# EAGLE design speedometer (EAGLE 9.1.3)

## Sheet 1 of 7: Main chip
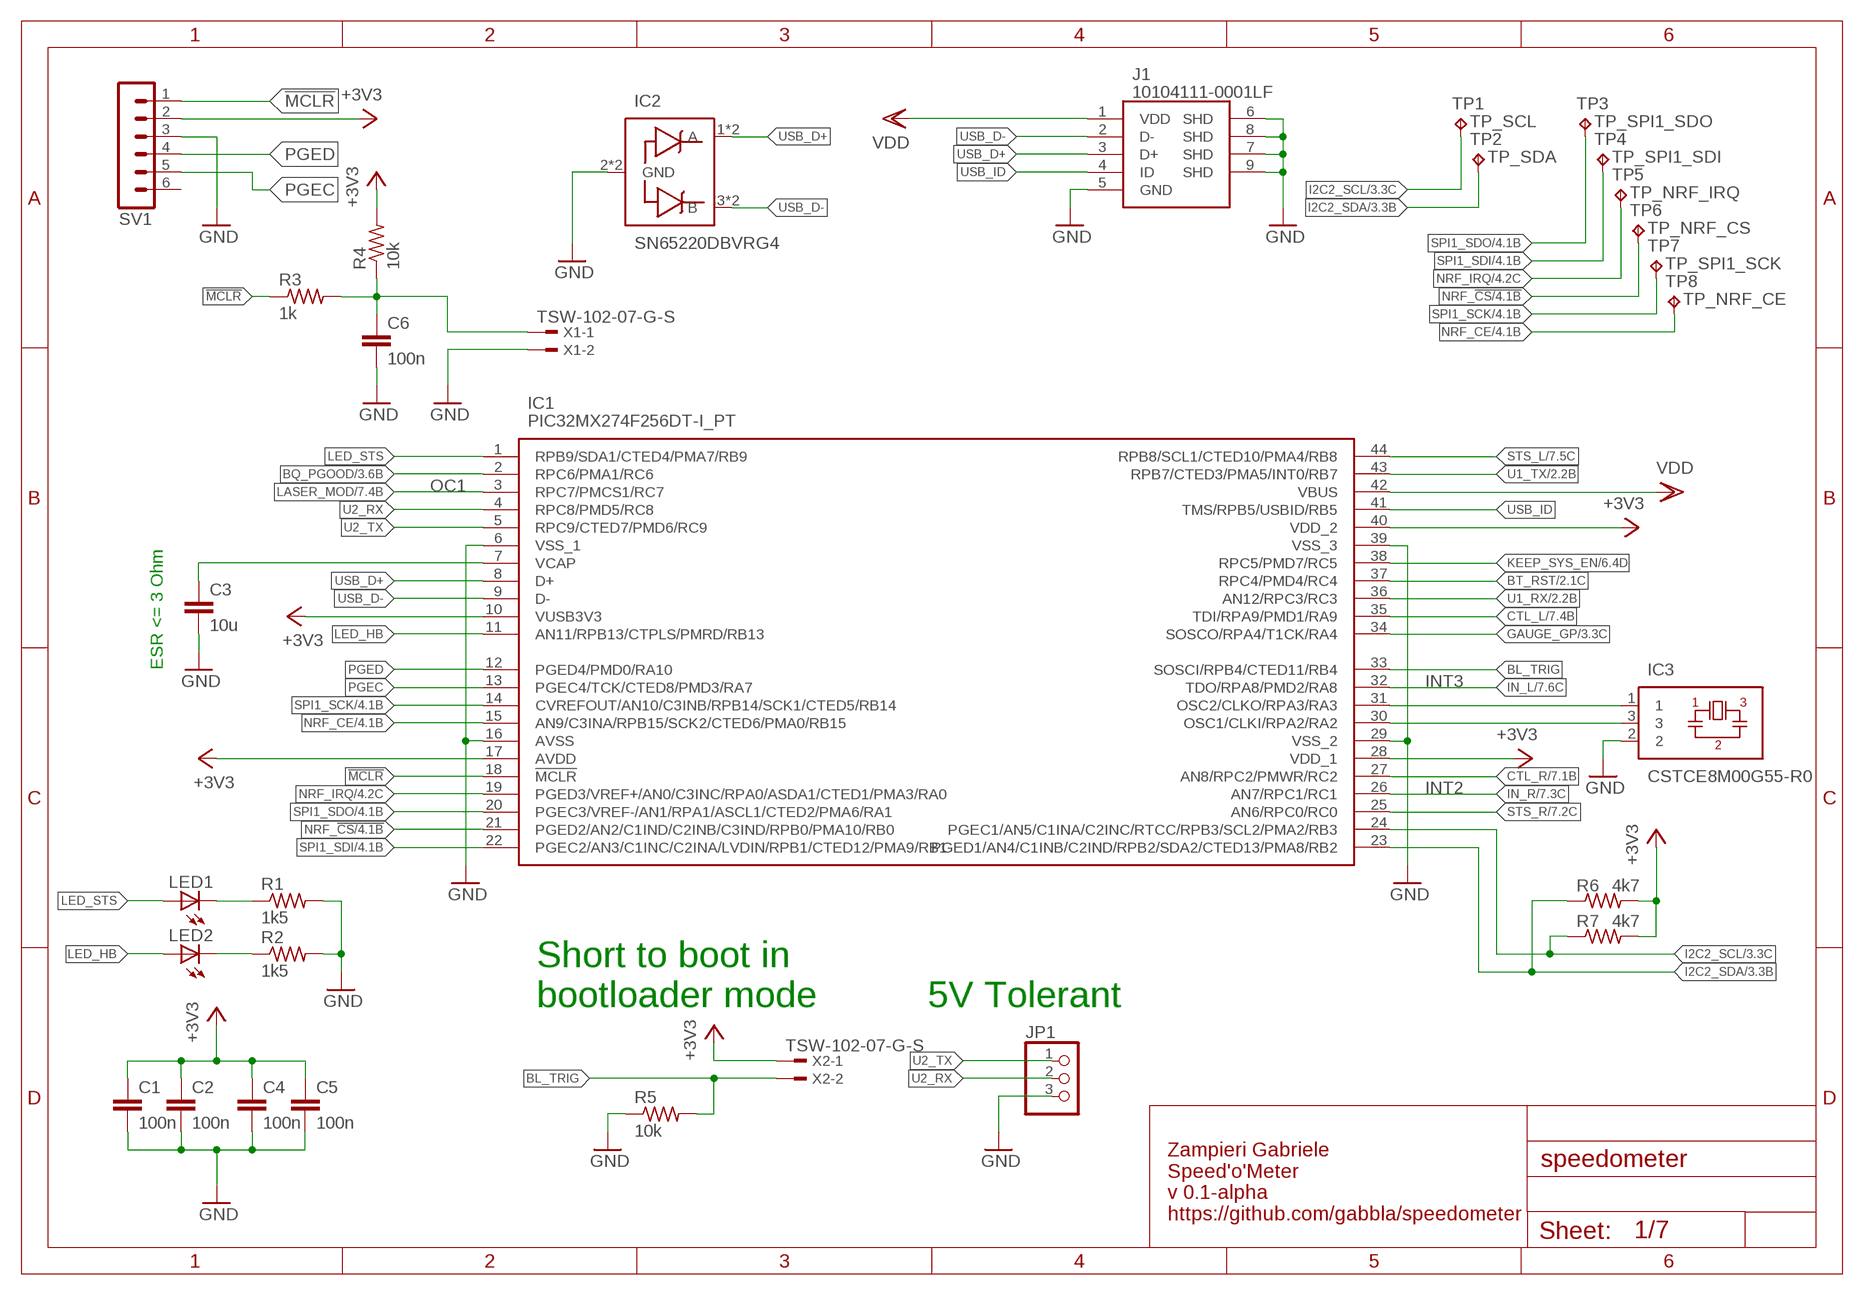
[diagram p0: schematic, sheet 1]

### Parts
C1  100n  C-EUC0603K  [C0603K]
C2  100n  C-EUC0603K  [C0603K]
C3  10u  C-EUC0805K  [C0805K]
C4  100n  C-EUC0603K  [C0603K]
C5  100n  C-EUC0603K  [C0603K]
C6  100n  C-EUC0603K  [C0603K]
IC1  PIC32MX274F256DT-I_PT  [QFP80P1200X1200X120-44N]
IC2  SN65220DBVRG4  [SOT95P280X145-6N]
IC3  CSTCE8M00G55-R0  CSTCE12M0G15L99-R0  [CSTCE_G]
J1  10104111-0001LF  [MICRO_USB_A/B_TYPE_RECEPTACLE]
JP1  PINHD-1X3  [1X03]
LED1  LED3MM  [LED3MM]
LED2  LEDCHIPLED_0805  [CHIPLED_0805]
R1  1k5  R-US_R0603  [R0603]
R2  1k5  R-US_R0603  [R0603]
R3  1k  R-US_R0603  [R0603]
R4  10k  R-US_R0603  [R0603]
R5  10k  R-US_R0603  [R0603]
R6  4k7  R-US_R0603  [R0603]
R7  4k7  R-US_R0603  [R0603]
SV1  MA06-1  [MA06-1]
TP1  TPB1,27  [B1,27]
TP2  TPB1,27  [B1,27]
TP3  TPB1,27  [B1,27]
TP4  TPB1,27  [B1,27]
TP5  TPB1,27  [B1,27]
TP6  TPB1,27  [B1,27]
TP7  TPB1,27  [B1,27]
TP8  TPB1,27  [B1,27]
X1  TSW-102-07-G-S  [TSW-102-XX-G-S]
X2  TSW-102-07-G-S  [TSW-102-XX-G-S]

### Nets
!MCLR: IC1.18(!MCLR) R3.1 SV1.1
+3V3: C1.1 C2.1 C4.1 C5.1 IC1.10(VUSB3V3) IC1.17(AVDD) IC1.28(VDD_1) IC1.40(VDD_2) R4.2 R6.2 R7.2 SV1.2 X2.1 ; also sheet 2,3,4,5,6,7
BL_TRIG: IC1.33(SOSCI/RPB4/CTED11/RB4) R5.2 X2.2
BQ_PGOOD: IC1.2(RPC6/PMA1/RC6) ; also sheet 3
BT_RST: IC1.37(RPC4/PMD4/RC4) ; also sheet 2
CTL_L: IC1.35(TDI/RPA9/PMD1/RA9) ; also sheet 7
CTL_R: IC1.27(AN8/RPC2/PMWR/RC2) ; also sheet 7
GAUGE_GP: IC1.34(SOSCO/RPA4/T1CK/RA4) ; also sheet 3
GND: C1.2 C2.2 C3.2 C4.2 C5.2 C6.2 IC1.6(VSS_1) IC1.16(AVSS) IC1.29(VSS_2) IC1.39(VSS_3) IC2.2(GND) IC2.5(GND) IC3.2 J1.5(GND) J1.6(SHD) J1.7(SHD) J1.8(SHD) J1.9(SHD) JP1.3 R1.2 R2.2 R5.1 SV1.3 X1.2 ; also sheet 2,3,4,5,6,7
I2C2_SCL: IC1.24(PGEC1/AN5/C1INA/C2INC/RTCC/RPB3/SCL2/PMA2/RB3) R7.1 TP1.TP ; also sheet 3,5
I2C2_SDA: IC1.23(PGED1/AN4/C1INB/C2IND/RPB2/SDA2/CTED13/PMA8/RB2) R6.1 TP2.TP ; also sheet 3,5
IN_L: IC1.32(TDO/RPA8/PMD2/RA8) ; also sheet 7
IN_R: IC1.26(AN7/RPC1/RC1) ; also sheet 7
KEEP_SYS_EN: IC1.38(RPC5/PMD7/RC5) ; also sheet 6
LASER_MOD: IC1.3(RPC7/PMCS1/RC7) ; also sheet 7
LED_HB: IC1.11(AN11/RPB13/CTPLS/PMRD/RB13) LED2.A
LED_STS: IC1.1(RPB9/SDA1/CTED4/PMA7/RB9) LED1.A
N$10: LED1.K(C) R1.1
N$11: IC1.31(OSC2/CLKO/RPA3/RA3) IC3.1
N$19: IC1.30(OSC1/CLKI/RPA2/RA2) IC3.3
N$21: C3.1 IC1.7(VCAP)
N$29: LED2.C R2.1
N$41: C6.1 R3.2 R4.1 X1.1
NRF_!CS: IC1.21(PGED2/AN2/C1IND/C2INB/C3IND/RPB0/PMA10/RB0) TP6.TP ; also sheet 4
NRF_CE: IC1.15(AN9/C3INA/RPB15/SCK2/CTED6/PMA0/RB15) TP8.TP ; also sheet 4
NRF_IRQ: IC1.19(PGED3/VREF+/AN0/C3INC/RPA0/ASDA1/CTED1/PMA3/RA0) TP5.TP ; also sheet 4
PGEC: IC1.13(PGEC4/TCK/CTED8/PMD3/RA7) SV1.5
PGED: IC1.12(PGED4/PMD0/RA10) SV1.4
SPI1_SCK: IC1.14(CVREFOUT/AN10/C3INB/RPB14/SCK1/CTED5/RB14) TP7.TP ; also sheet 4
SPI1_SDI: IC1.22(PGEC2/AN3/C1INC/C2INA/LVDIN/RPB1/CTED12/PMA9/RB1) TP4.TP ; also sheet 4
SPI1_SDO: IC1.20(PGEC3/VREF-/AN1/RPA1/ASCL1/CTED2/PMA6/RA1) TP3.TP ; also sheet 4
STS_L: IC1.44(RPB8/SCL1/CTED10/PMA4/RB8) ; also sheet 7
STS_R: IC1.25(AN6/RPC0/RC0) ; also sheet 7
U1_RX: IC1.36(AN12/RPC3/RC3) ; also sheet 2
U1_TX: IC1.43(RPB7/CTED3/PMA5/INT0/RB7) ; also sheet 2
U2_RX: IC1.4(RPC8/PMD5/RC8) JP1.2
U2_TX: IC1.5(RPC9/CTED7/PMD6/RC9) JP1.1
USB_D+: IC1.8(D+) IC2.1(A) IC2.6(A) J1.3(D+)
USB_D-: IC1.9(D-) IC2.3(B) IC2.4(B) J1.2(D-)
USB_ID: IC1.41(TMS/RPB5/USBID/RB5) J1.4(ID)
VDD: IC1.42(VBUS) J1.1(VDD) ; also sheet 3
Unconnected: SV1.6

### Notes on the sheet
- OC1
- ESR <= 3 Ohm
- INT3
- INT2
- Short to boot in
  bootloader mode
- 5V Tolerant
- Zampieri Gabriele
  Speed'o'Meter 
  v 0.1-alpha
  https://github.com/gabbla/speedometer

## Sheet 2 of 7: NPI
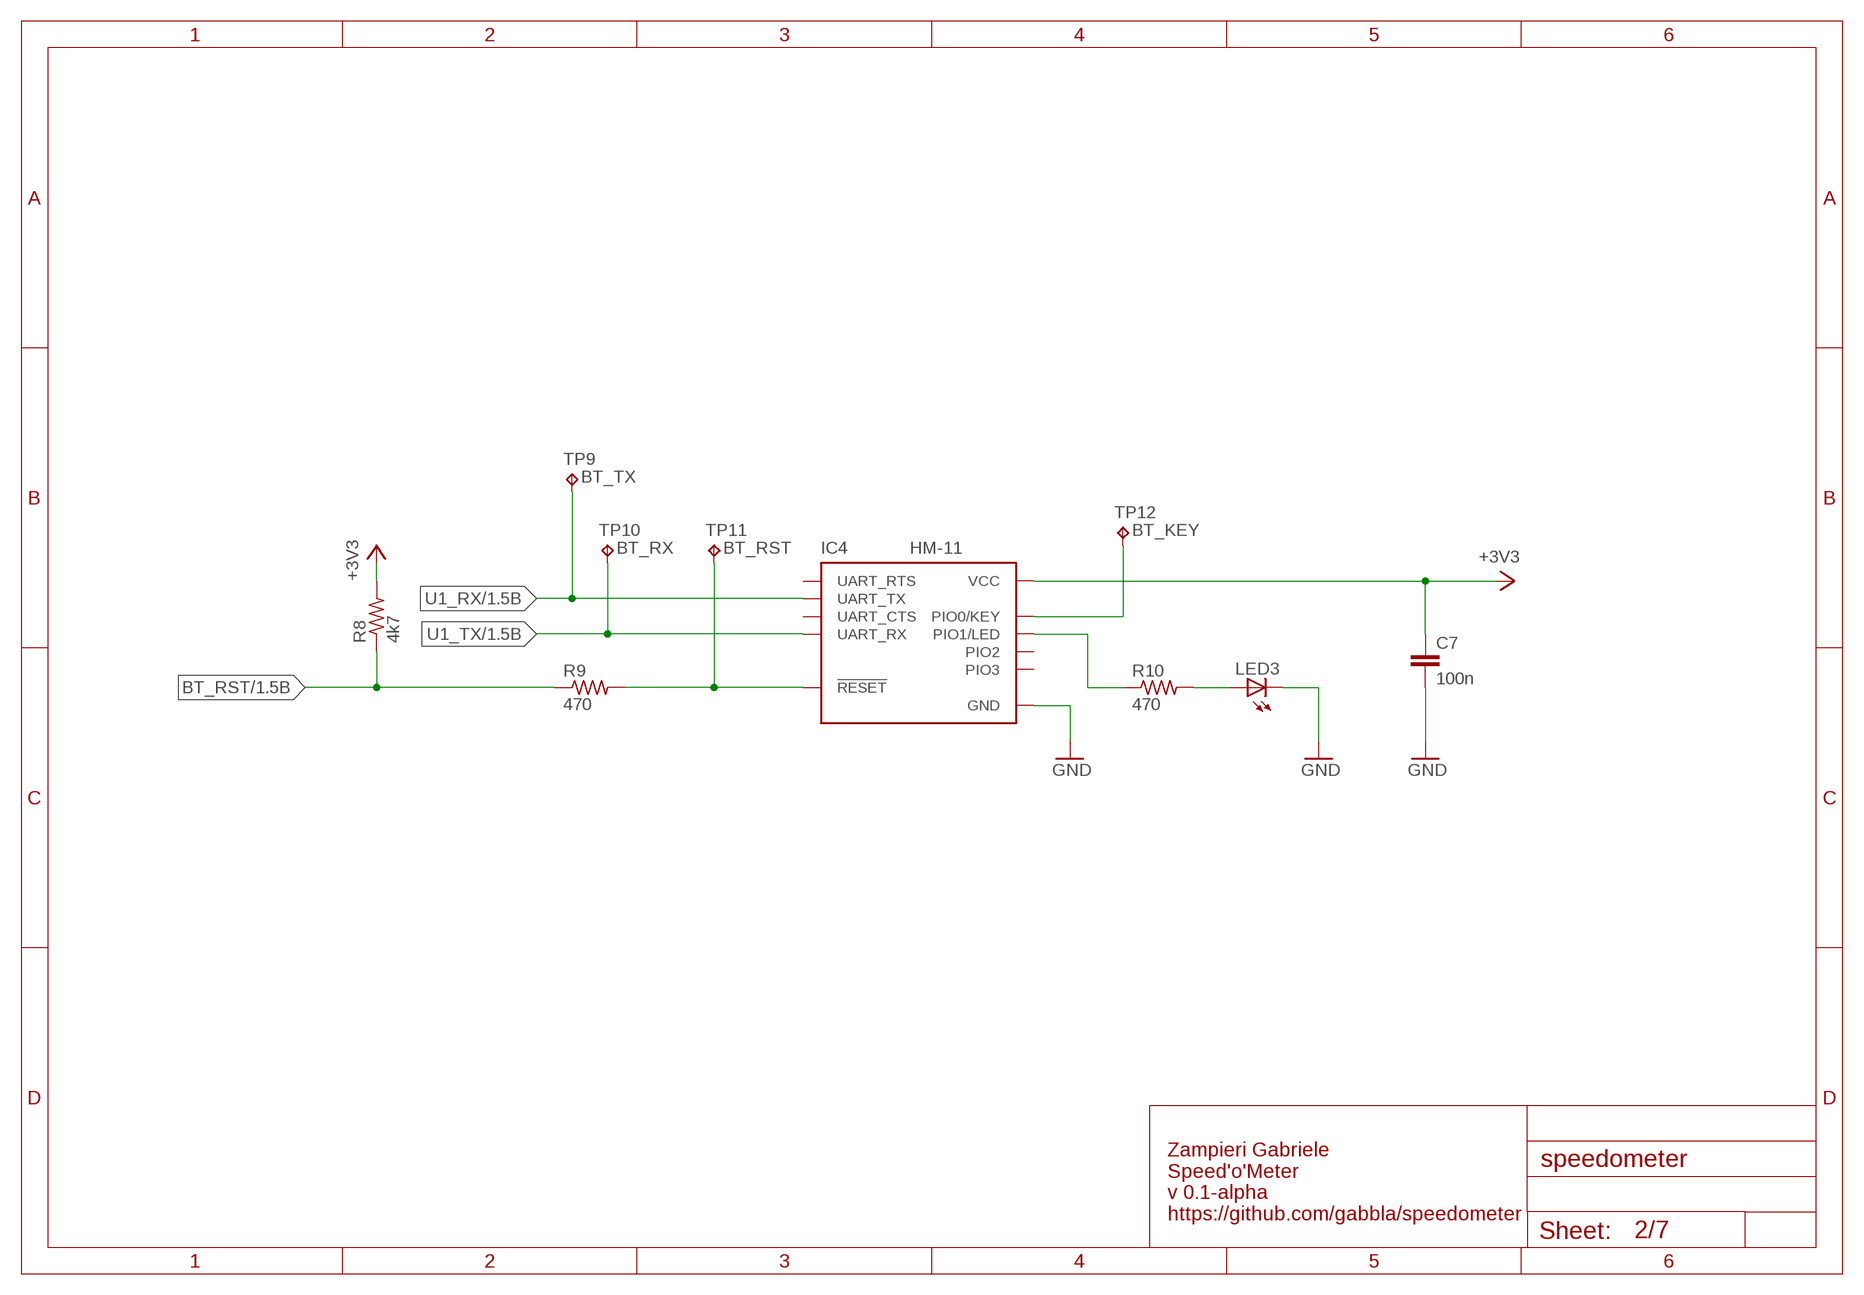
[diagram p1: schematic, sheet 2]

### Parts
C7  100n  C-EUC0603K  [C0603K]
IC4  HM-11  [HM-11]
LED3  LED3MM  [LED3MM]
R8  4k7  R-US_R0603  [R0603]
R9  470  R-US_R0603  [R0603]
R10  470  R-US_R0603  [R0603]
TP9  TPB1,27  [B1,27]
TP10  TPB1,27  [B1,27]
TP11  TPB1,27  [B1,27]
TP12  TPB1,27  [B1,27]

### Nets
+3V3: C7.1 IC4.VCC R8.2 ; also sheet 1,3,4,5,6,7
BT_RST: R8.1 R9.1 ; also sheet 1
GND: C7.2 IC4.GND LED3.K(C) ; also sheet 1,3,4,5,6,7
N$1: IC4.RESETB(!RESET) R9.2 TP11.TP
N$2: IC4.PIO0(PIO0/KEY) TP12.TP
N$4: IC4.PIO1(PIO1/LED) R10.1
N$6: LED3.A R10.2
U1_RX: IC4.UART_TX TP9.TP ; also sheet 1
U1_TX: IC4.UART_RX TP10.TP ; also sheet 1
Unconnected: IC4.PIO2 IC4.PIO3 IC4.UART_CTS IC4.UART_RTS

### Notes on the sheet
- Zampieri Gabriele
  Speed'o'Meter 
  v 0.1-alpha
  https://github.com/gabbla/speedometer

## Sheet 3 of 7: Battery Managment
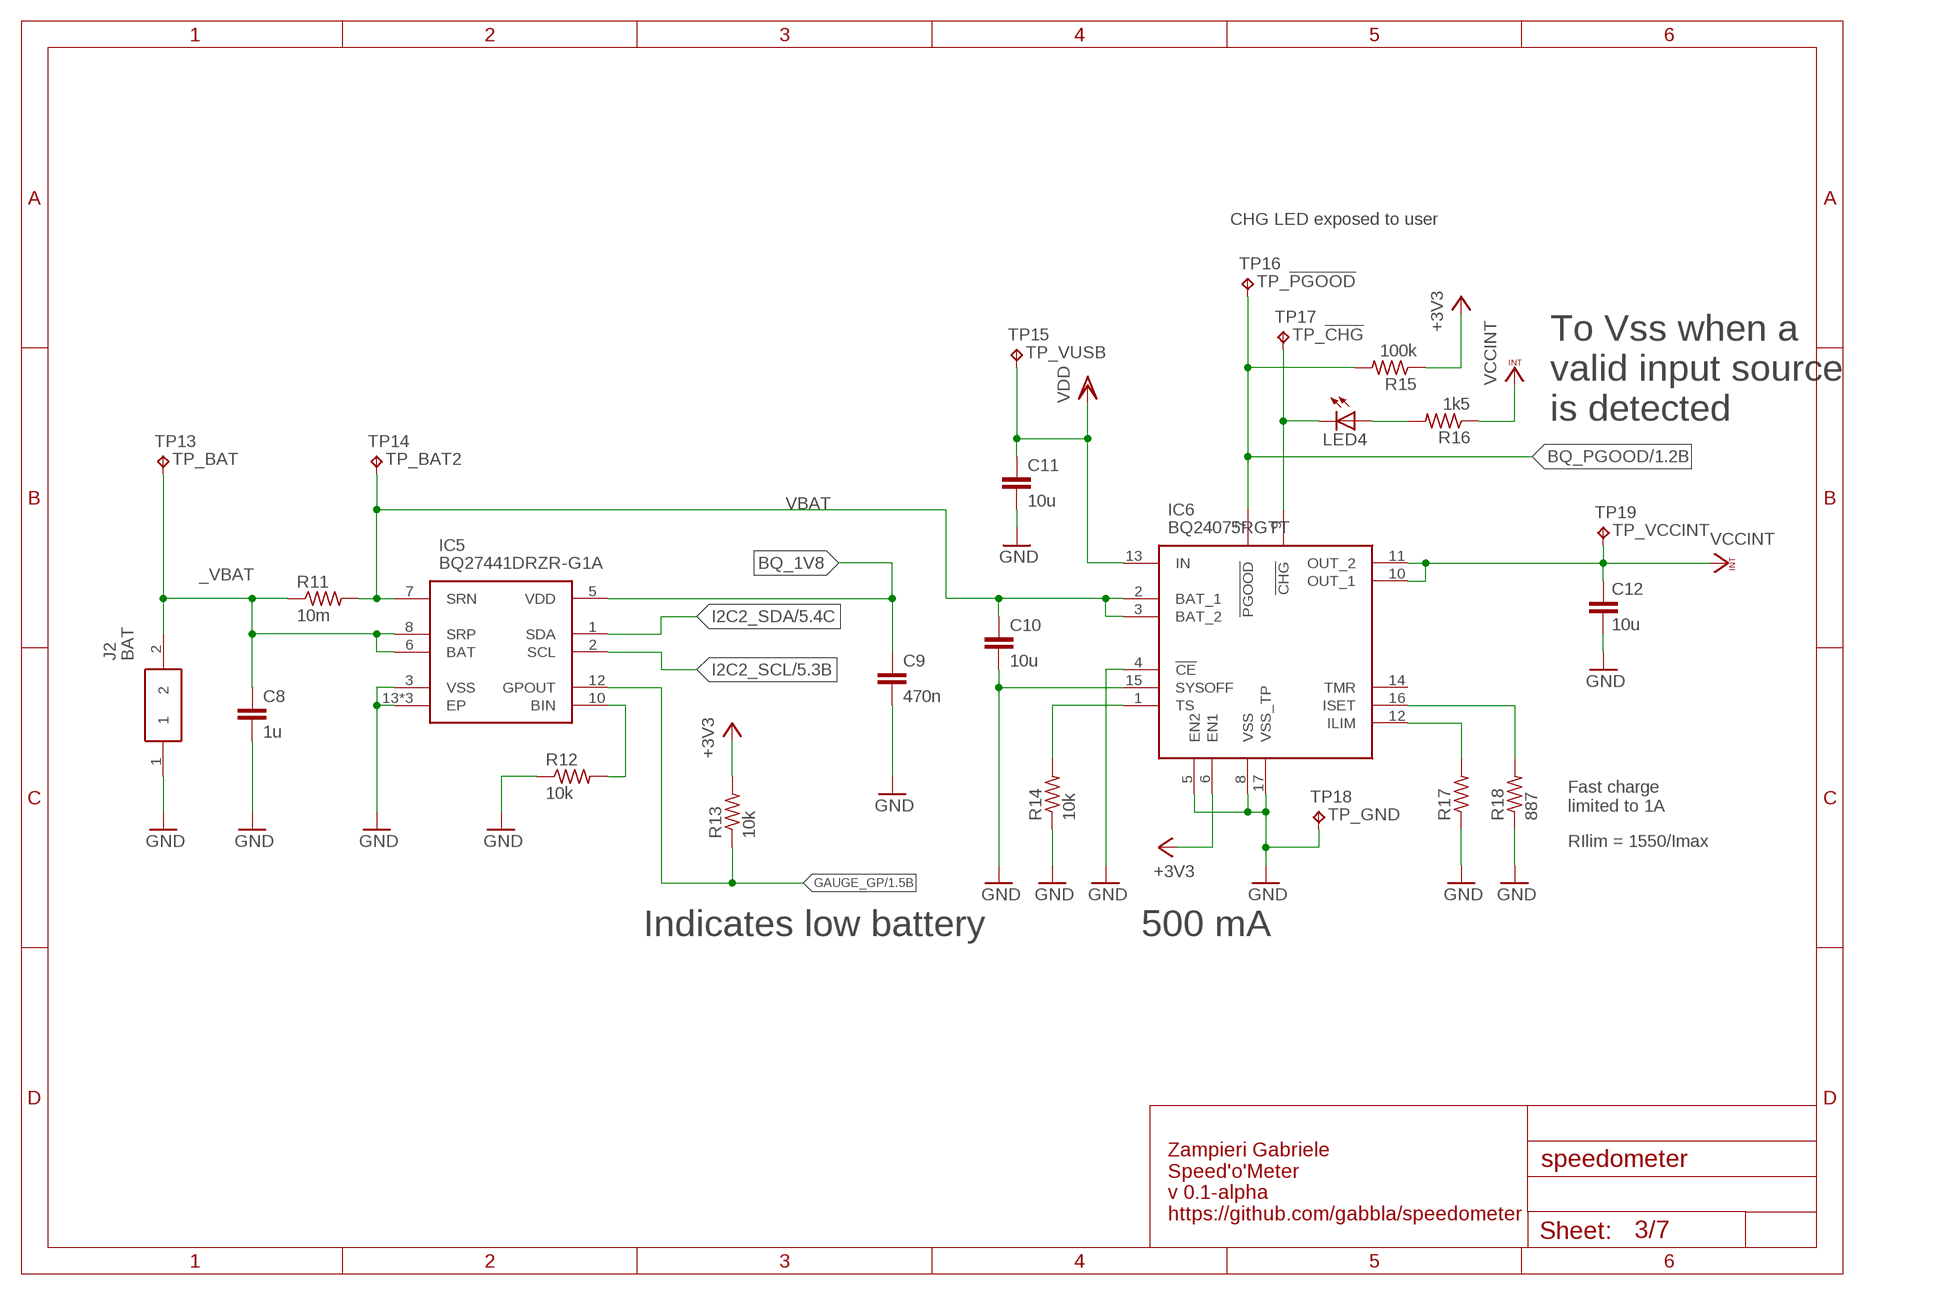
[diagram p2: schematic, sheet 3]

### Parts
C8  1u  C-EUC0603K  [C0603K]
C9  470n  C-EUC0603K  [C0603K]
C10  10u  C-EUC0805K  [C0805K]
C11  10u  C-EUC0805K  [C0805K]
C12  10u  C-EUC0805K  [C0805K]
IC5  BQ27441DRZR-G1A  [BQ27441DRZRG1A]
IC6  BQ24075RGTT  [QFN50P300X300X80-17N]
J2  BAT  B2B-PH-SM4-TB(LF)(SN)  [B2B-PH-SM4-TB]
LED4  LED3MM  [LED3MM]
R11  10m  R-US_R2512  [R2512]
R12  10k  R-US_R0603  [R0603]
R13  10k  R-US_R0603  [R0603]
R14  10k  R-US_R0603  [R0603]
R15  100k  R-US_R0603  [R0603]
R16  1k5  R-US_R0603  [R0603]
R17  R-US_R0603  [R0603]
R18  887  R-US_R0603  [R0603]
TP13  TPB1,27  [B1,27]
TP14  TPB1,27  [B1,27]
TP15  TPB1,27  [B1,27]
TP16  TPB1,27  [B1,27]
TP17  TPB1,27  [B1,27]
TP18  TPB1,27  [B1,27]
TP19  TPB1,27  [B1,27]

### Nets
!BAT_CHG: IC6.9(!CHG) LED4.K(C) TP17.TP
+3V3: IC6.6(EN1) R13.2 R15.1 ; also sheet 1,2,4,5,6,7
_VBAT: C8.1 IC5.6(BAT) IC5.8(SRP) J2.2 R11.1 TP13.TP
BQ_1V8: C9.1 IC5.5(VDD)
BQ_PGOOD: IC6.7(!PGOOD) R15.2 TP16.TP ; also sheet 1
GAUGE_GP: IC5.12(GPOUT) R13.1 ; also sheet 1
GND: C8.2 C9.2 C10.2 C11.2 C12.2 IC5.3(VSS) IC5.13(EP) IC5.14(EP) IC5.15(EP) IC6.4(!CE) IC6.5(EN2) IC6.8(VSS) IC6.15(SYSOFF) IC6.17(VSS_TP) J2.1 R12.1 R14.1 R17.1 R18.1 TP18.TP ; also sheet 1,2,4,5,6,7
I2C2_SCL: IC5.2(SCL) ; also sheet 1,5
I2C2_SDA: IC5.1(SDA) ; also sheet 1,5
N$7: IC6.1(TS) R14.2
N$8: IC6.12(ILIM) R17.2
N$9: IC6.16(ISET) R18.2
N$12: LED4.A R16.2
N$30: IC5.10(BIN) R12.2
VBAT: C10.1 IC5.7(SRN) IC6.2(BAT_1) IC6.3(BAT_2) R11.2 TP14.TP
VCCINT: C12.1 IC6.10(OUT_1) IC6.11(OUT_2) R16.1 TP19.TP ; also sheet 6
VDD: C11.1 IC6.13(IN) TP15.TP ; also sheet 1
Unconnected: IC6.14(TMR)

### Notes on the sheet
- CHG LED exposed to user
- To Vss when a 
  valid input source
  is detected
- Fast charge
  limited to 1A
- RIlim = 1550/Imax
- Indicates low battery | 500 mA
- Zampieri Gabriele
  Speed'o'Meter 
  v 0.1-alpha
  https://github.com/gabbla/speedometer

## Sheet 4 of 7: nRF24L01+
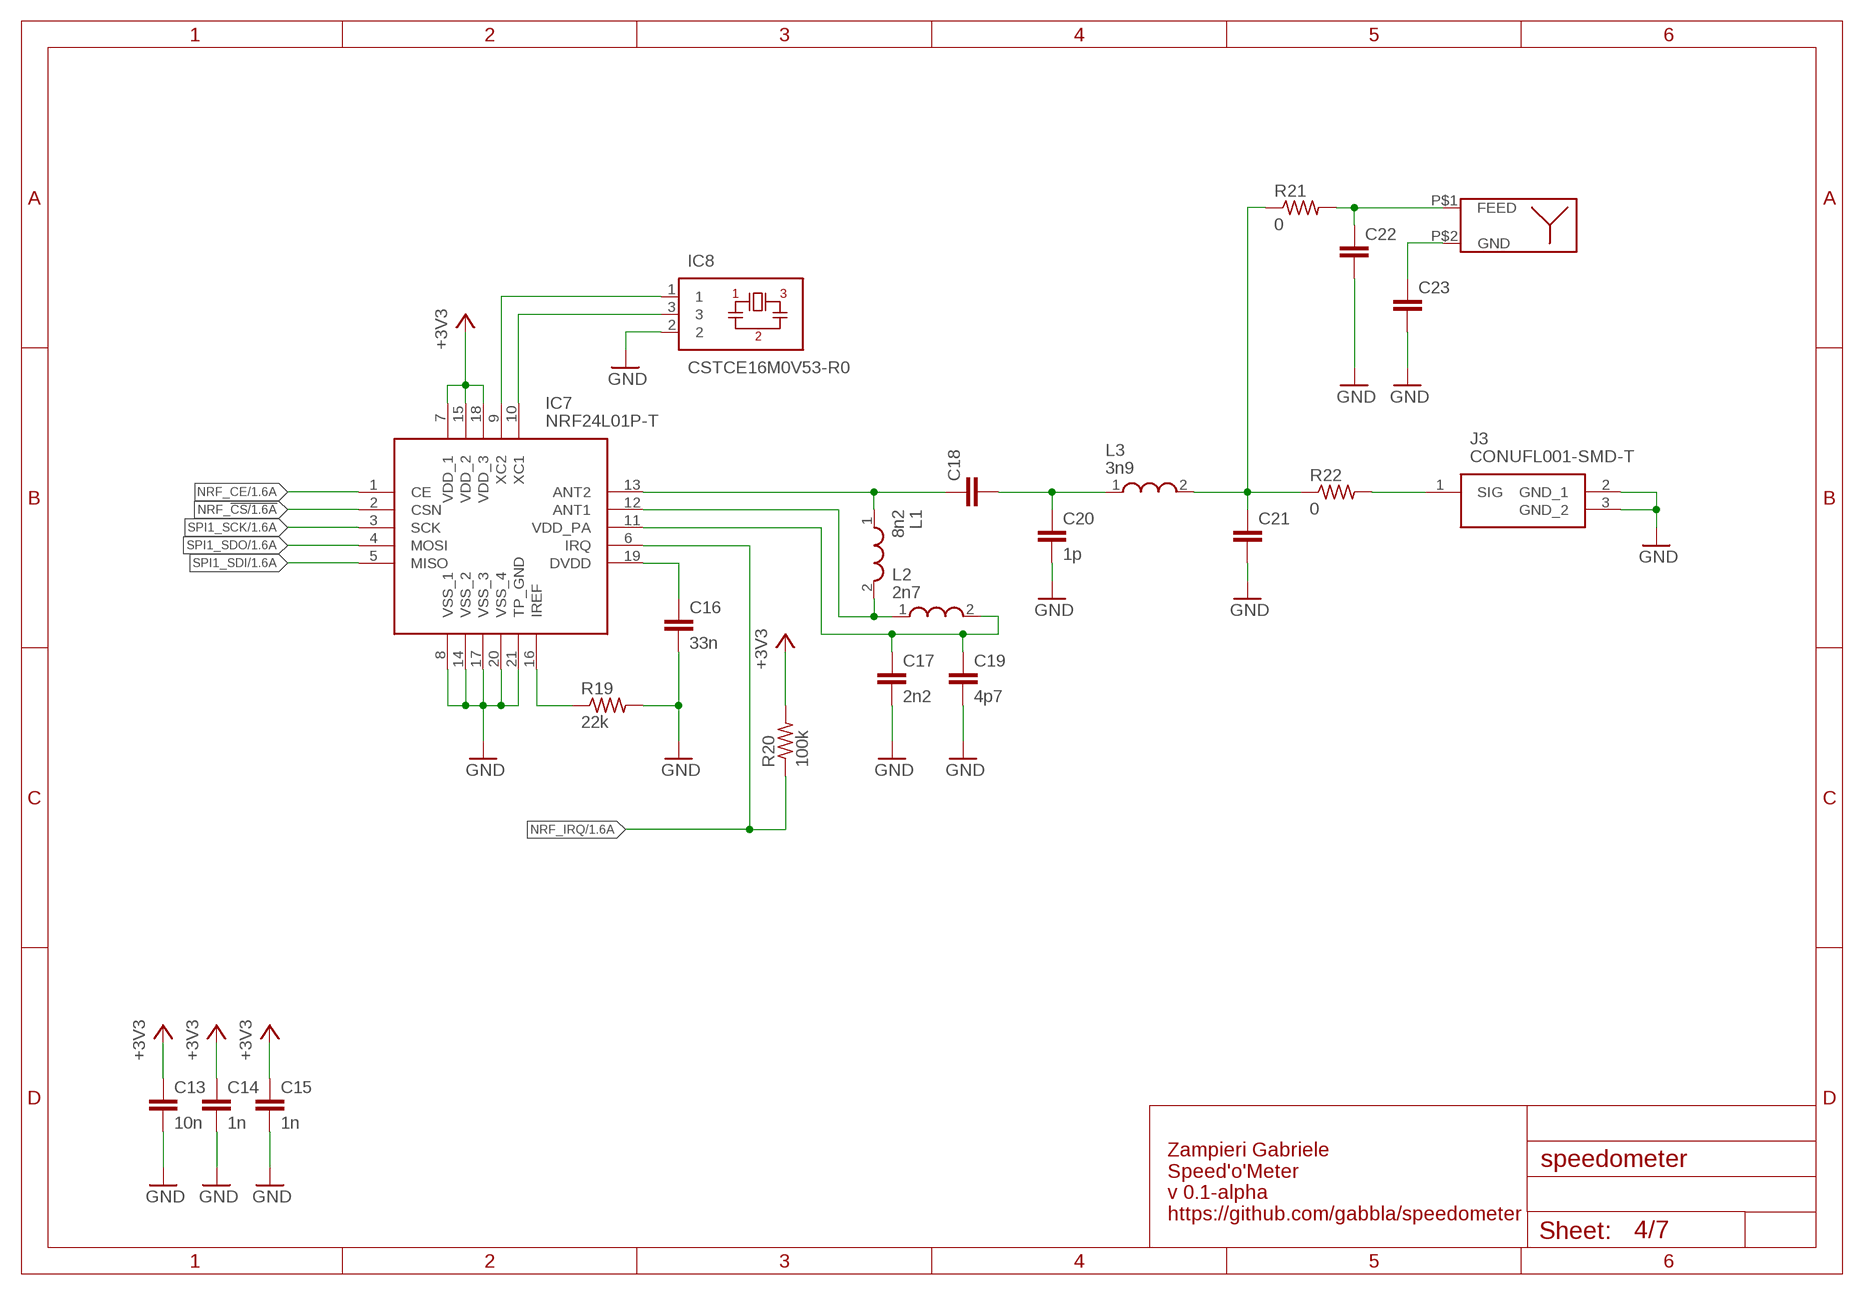
[diagram p3: schematic, sheet 4]

### Parts
ANT1  M310210  [M310210]
C13  10n  C-EUC0603K  [C0603K]
C14  1n  C-EUC0603K  [C0603K]
C15  1n  C-EUC0603K  [C0603K]
C16  33n  C-EUC0402K  [C0402K]
C17  2n2  C-EUC0402K  [C0402K]
C18  C-EUC0402K  [C0402K]
C19  4p7  C-EUC0402K  [C0402K]
C20  1p  C-EUC0402K  [C0402K]
C21  C-EUC0402K  [C0402K]
C22  C-EUC0402K  [C0402K]
C23  C-EUC0402K  [C0402K]
IC7  NRF24L01P-T  [QFN50P400X400X95-21N]
IC8  CSTCE16M0V53-R0  CSTCE12M0G15L99-R0  [CSTCE_G]
J3  CONUFL001-SMD-T  [CONUFL001-SMD]
L1  8n2  INDUCTOR  [C0402K]
L2  2n7  INDUCTOR  [C0402K]
L3  3n9  INDUCTOR  [C0402K]
R19  22k  R-US_R0603  [R0603]
R20  100k  R-US_R0603  [R0603]
R21  0  R-US_R0402  [R0402]
R22  0  R-US_R0402  [R0402]

### Nets
+3V3: C13.1 C14.1 C15.1 IC7.7(VDD_1) IC7.15(VDD_2) IC7.18(VDD_3) R20.2 ; also sheet 1,2,3,5,6,7
GND: C13.2 C14.2 C15.2 C16.2 C17.2 C19.2 C20.2 C21.2 C22.2 C23.2 IC7.8(VSS_1) IC7.14(VSS_2) IC7.17(VSS_3) IC7.20(VSS_4) IC7.21(TP_GND) IC8.2 J3.2(GND_1) J3.3(GND_2) R19.2 ; also sheet 1,2,3,5,6,7
N$17 [antenna]: C18.2 C20.1 L3.1
N$20 [antenna]: C21.1 L3.2 R21.1 R22.1
N$22: IC7.9(XC2) IC8.1
N$23 [antenna]: J3.1(SIG) R22.2
N$24: IC7.16(IREF) R19.1
N$25: C16.1 IC7.19(DVDD)
N$31: IC7.10(XC1) IC8.3
N$32 [antenna]: C18.1 IC7.13(ANT2) L1.1
N$33 [antenna]: IC7.12(ANT1) L1.2 L2.1
N$35 [antenna]: C17.1 C19.1 IC7.11(VDD_PA) L2.2
N$36: ANT1.P$2(GND) C23.1
N$37: ANT1.P$1(FEED) C22.1 R21.2
NRF_!CS: IC7.2(CSN) ; also sheet 1
NRF_CE: IC7.1(CE) ; also sheet 1
NRF_IRQ: IC7.6(IRQ) R20.1 ; also sheet 1
SPI1_SCK: IC7.3(SCK) ; also sheet 1
SPI1_SDI: IC7.5(MISO) ; also sheet 1
SPI1_SDO: IC7.4(MOSI) ; also sheet 1

### Notes on the sheet
- Zampieri Gabriele
  Speed'o'Meter 
  v 0.1-alpha
  https://github.com/gabbla/speedometer

## Sheet 5 of 7: I2C EEPROM
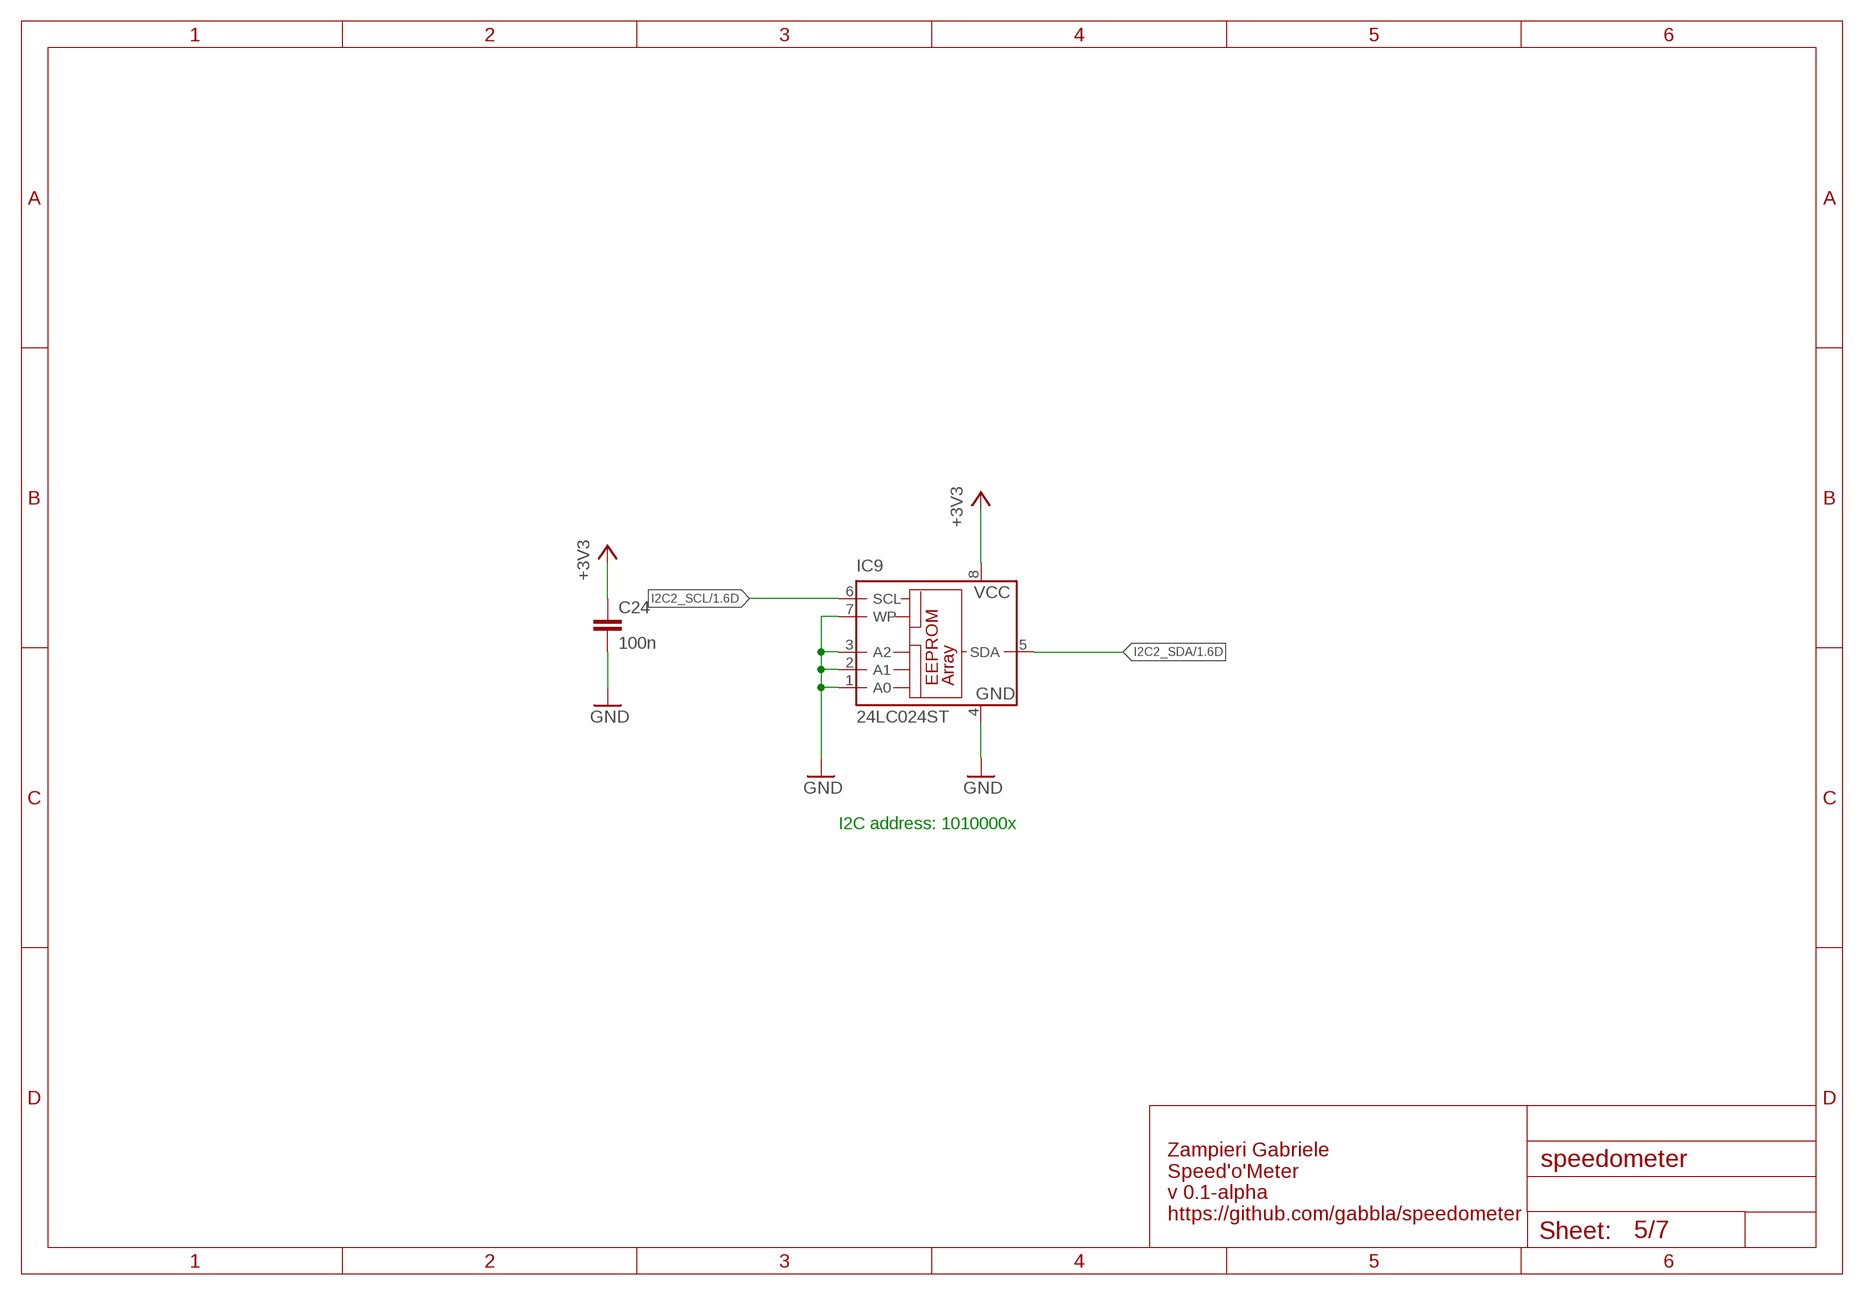
[diagram p4: schematic, sheet 5]

### Parts
C24  100n  C-EUC0603K  [C0603K]
IC9  24LC024ST  [TSSOP8]

### Nets
+3V3: C24.1 IC9.8(VCC) ; also sheet 1,2,3,4,6,7
GND: C24.2 IC9.1(A0) IC9.2(A1) IC9.3(A2) IC9.4(GND) IC9.7(WP) ; also sheet 1,2,3,4,6,7
I2C2_SCL: IC9.6(SCL) ; also sheet 1,3
I2C2_SDA: IC9.5(SDA) ; also sheet 1,3

### Notes on the sheet
- I2C address: 1010000x
- Zampieri Gabriele
  Speed'o'Meter 
  v 0.1-alpha
  https://github.com/gabbla/speedometer

## Sheet 6 of 7: Voltage regulators
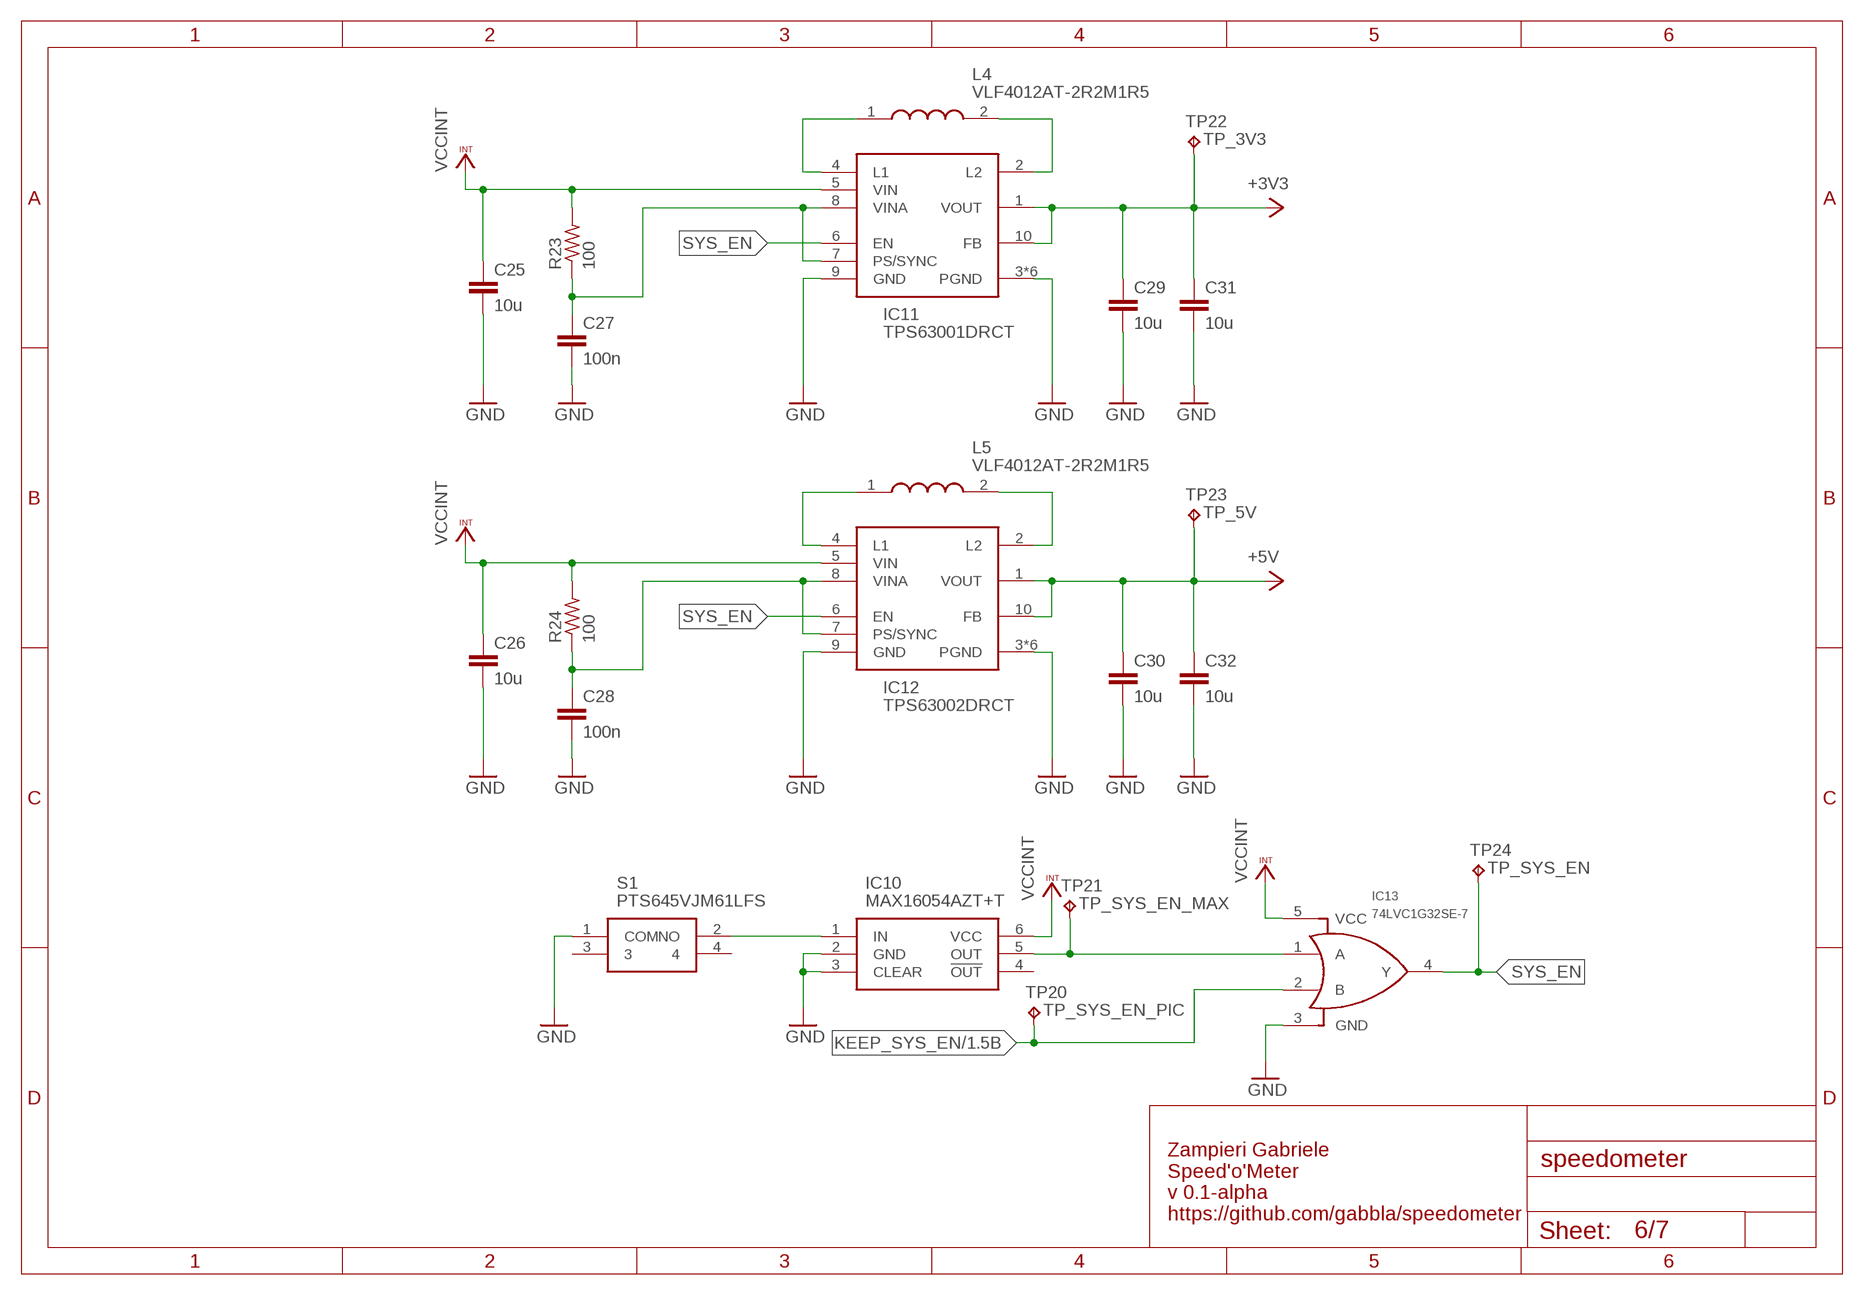
[diagram p5: schematic, sheet 6]

### Parts
C25  10u  C-EUC0805K  [C0805K]
C26  10u  C-EUC0805K  [C0805K]
C27  100n  C-EUC0603K  [C0603K]
C28  100n  C-EUC0603K  [C0603K]
C29  10u  C-EUC0805K  [C0805K]
C30  10u  C-EUC0805K  [C0805K]
C31  10u  C-EUC0805K  [C0805K]
C32  10u  C-EUC0805K  [C0805K]
IC10  MAX16054AZT+T  [SOT95P275X110-6N]
IC11  TPS63001DRCT  TPS63000DRCT  [SON50P300X300X100-11N]
IC12  TPS63002DRCT  TPS63000DRCT  [SON50P300X300X100-11N]
IC13  74LVC1G32SE-7  [SOT353]
L4  VLF4012AT-2R2M1R5  LPS3015-222MRB  [LPS3015]
L5  VLF4012AT-2R2M1R5  LPS3015-222MRB  [LPS3015]
R23  100  R-US_R0603  [R0603]
R24  100  R-US_R0603  [R0603]
S1  PTS645VJM61LFS  [PTS645VJM61LFS]
TP20  TPB1,27  [B1,27]
TP21  TPB1,27  [B1,27]
TP22  TPB1,27  [B1,27]
TP23  TPB1,27  [B1,27]
TP24  TPB1,27  [B1,27]

### Nets
+3V3: C29.1 C31.1 IC11.1(VOUT) IC11.10(FB) TP22.TP ; also sheet 1,2,3,4,5,7
+5V: C30.1 C32.1 IC12.1(VOUT) IC12.10(FB) TP23.TP ; also sheet 7
GND: C25.2 C26.2 C27.2 C28.2 C29.2 C30.2 C31.2 C32.2 IC10.2(GND) IC10.3(CLEAR) IC11.3(PGND) IC11.9(GND) IC11.11(PGND) IC11.EP1(PGND) IC11.EP2(PGND) IC11.EP3(PGND) IC11.EP4(PGND) IC12.3(PGND) IC12.9(GND) IC12.11(PGND) IC12.EP1(PGND) IC12.EP2(PGND) IC12.EP3(PGND) IC12.EP4(PGND) IC13.3(GND) S1.1(COM) ; also sheet 1,2,3,4,5,7
KEEP_SYS_EN: IC13.2(B) TP20.TP ; also sheet 1
MAX_SYS_ON: IC10.5(OUT) IC13.1(A) TP21.TP
N$5: IC11.4(L1) L4.1
N$34: IC11.2(L2) L4.2
N$58: IC10.1(IN) S1.2(NO)
N$59: IC12.4(L1) L5.1
N$60: C27.1 IC11.7(PS/SYNC) IC11.8(VINA) R23.1
N$61: IC12.2(L2) L5.2
N$62: C28.1 IC12.7(PS/SYNC) IC12.8(VINA) R24.1
SYS_EN: IC11.6(EN) IC12.6(EN) IC13.4(Y) TP24.TP
VCCINT: C25.1 C26.1 IC10.6(VCC) IC11.5(VIN) IC12.5(VIN) IC13.5(VCC) R23.2 R24.2 ; also sheet 3
Unconnected: IC10.4(!OUT) S1.3 S1.4

### Notes on the sheet
- Zampieri Gabriele
  Speed'o'Meter 
  v 0.1-alpha
  https://github.com/gabbla/speedometer

## Sheet 7 of 7: Sensing
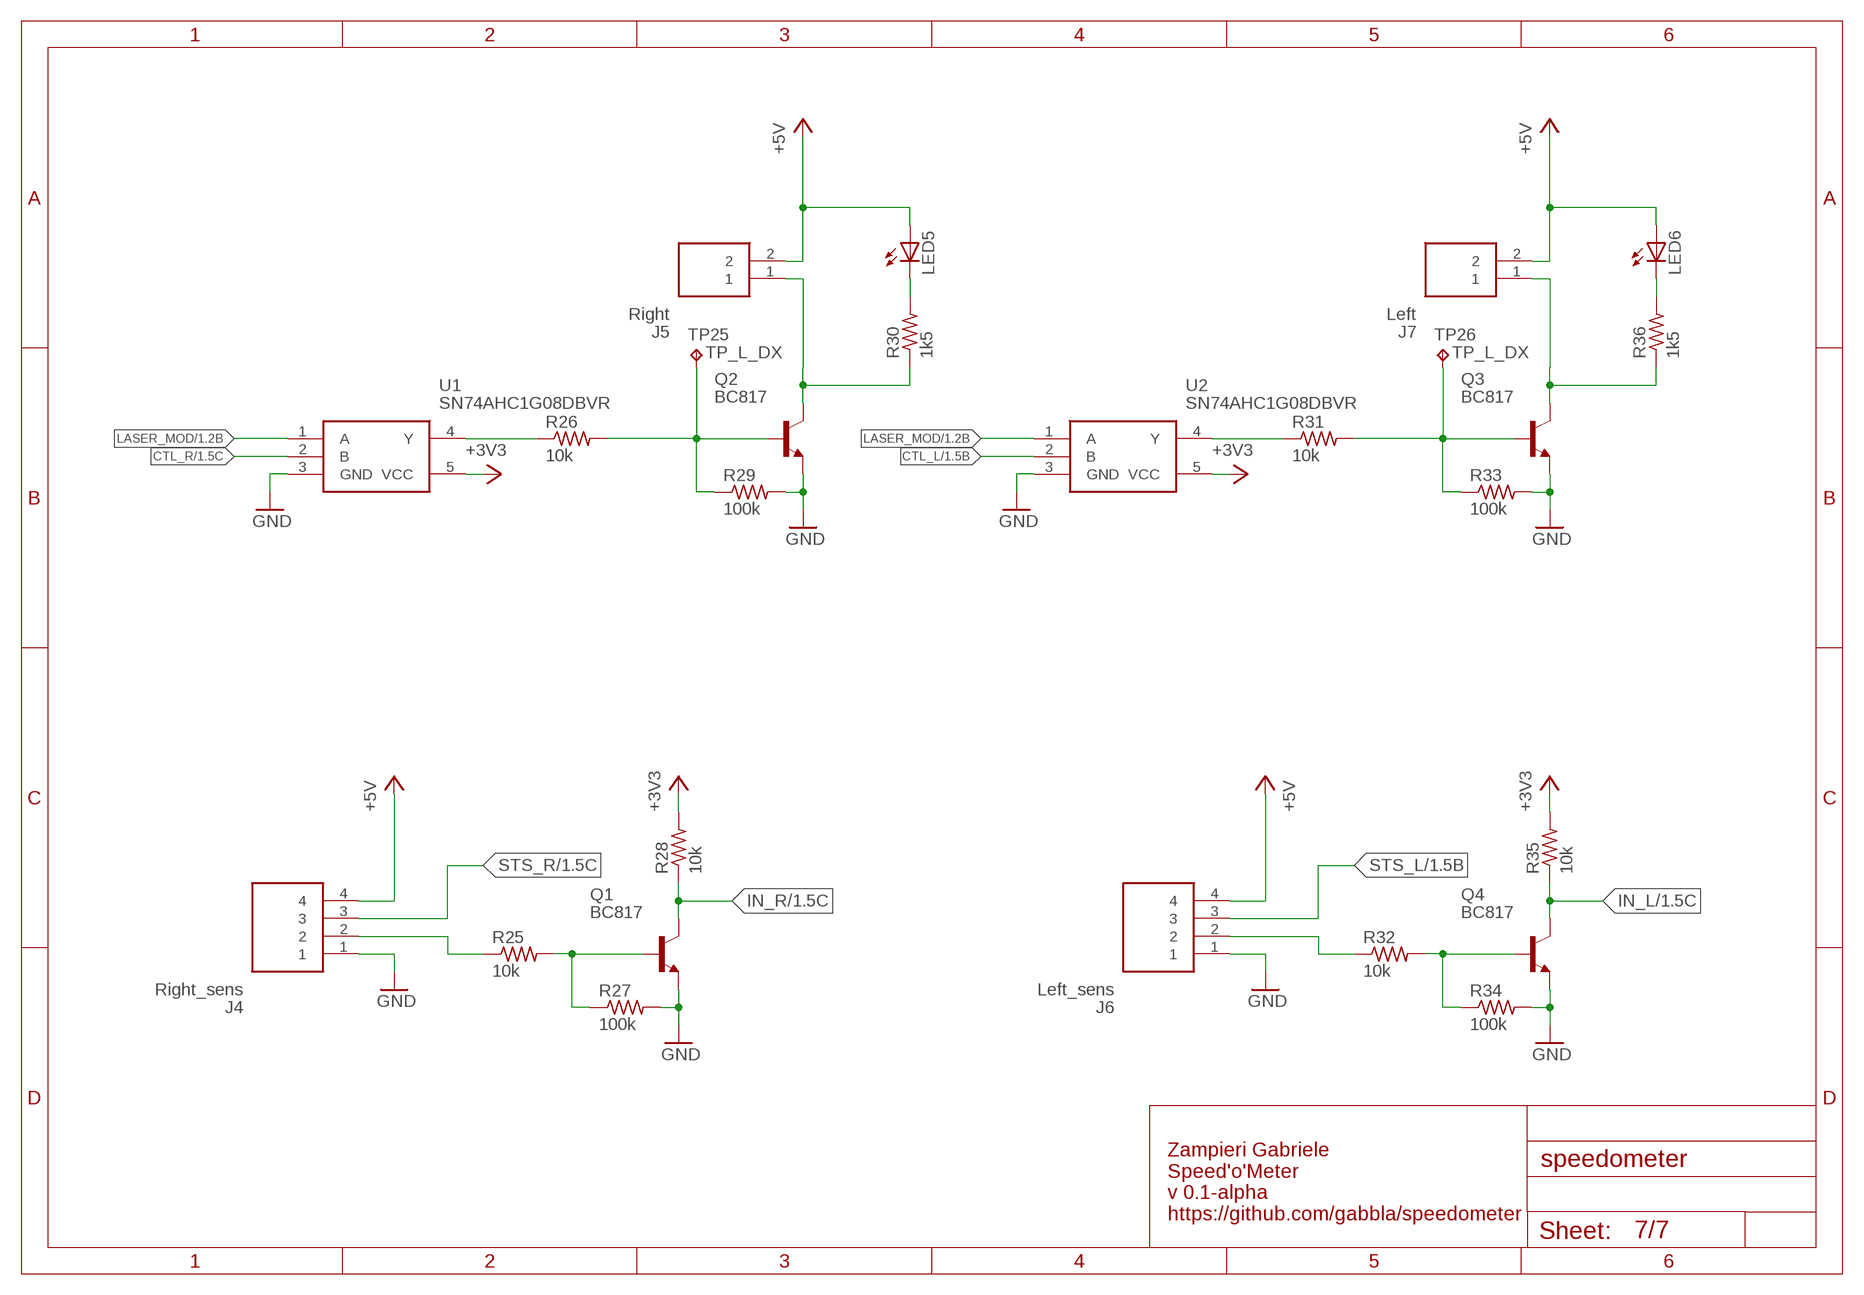
[diagram p6: schematic, sheet 7]

### Parts
J4  Right_sens  B4B-XH-A(LF)(SN)  [SHDR4W64P0X250_1X4_1240X575X70]
J5  Right  B2B-XH-A(LF)(SN)  [SHDR2W64P0X250_1X2_740X575X700]
J6  Left_sens  B4B-XH-A(LF)(SN)  [SHDR4W64P0X250_1X4_1240X575X70]
J7  Left  B2B-XH-A(LF)(SN)  [SHDR2W64P0X250_1X2_740X575X700]
LED5  LEDCHIPLED_1206  [CHIPLED_1206]
LED6  LEDCHIPLED_1206  [CHIPLED_1206]
Q1  BC817  BC817-16LT1SMD  [SOT23-BEC]
Q2  BC817  BC817-16LT1SMD  [SOT23-BEC]
Q3  BC817  BC817-16LT1SMD  [SOT23-BEC]
Q4  BC817  BC817-16LT1SMD  [SOT23-BEC]
R25  10k  R-US_R0603  [R0603]
R26  10k  R-US_R0603  [R0603]
R27  100k  R-US_R0603  [R0603]
R28  10k  R-US_R0603  [R0603]
R29  100k  R-US_R0603  [R0603]
R30  1k5  R-US_R0603  [R0603]
R31  10k  R-US_R0603  [R0603]
R32  10k  R-US_R0603  [R0603]
R33  100k  R-US_R0603  [R0603]
R34  100k  R-US_R0603  [R0603]
R35  10k  R-US_R0603  [R0603]
R36  1k5  R-US_R0603  [R0603]
TP25  TPB1,27  [B1,27]
TP26  TPB1,27  [B1,27]
U1  SN74AHC1G08DBVR  [SOT95P280X145-5N]
U2  SN74AHC1G08DBVR  [SOT95P280X145-5N]

### Nets
+3V3: R28.2 R35.2 U1.5(VCC) U2.5(VCC) ; also sheet 1,2,3,4,5,6
+5V: J4.4 J5.2 J6.4 J7.2 LED5.A LED6.A ; also sheet 6
CTL_L: U2.2(B) ; also sheet 1
CTL_R: U1.2(B) ; also sheet 1
GND: J4.1 J6.1 Q1.E Q2.E Q3.E Q4.E R27.2 R29.2 R33.2 R34.2 U1.3(GND) U2.3(GND) ; also sheet 1,2,3,4,5,6
IN_L: Q4.C R35.1 ; also sheet 1
IN_R: Q1.C R28.1 ; also sheet 1
LASER_MOD: U1.1(A) U2.1(A) ; also sheet 1
N$3: J7.1 Q3.C R36.1
N$13: Q4.B R32.2 R34.1
N$14: Q3.B R31.2 R33.1 TP26.TP
N$15: LED6.C R36.2
N$16: R31.1 U2.4(Y)
N$26: Q1.B R25.2 R27.1
N$27: J4.2 R25.1
N$28: J6.2 R32.1
N$38: J5.1 Q2.C R30.1
N$39: Q2.B R26.2 R29.1 TP25.TP
N$40: LED5.C R30.2
N$42: R26.1 U1.4(Y)
STS_L: J6.3 ; also sheet 1
STS_R: J4.3 ; also sheet 1

### Notes on the sheet
- Zampieri Gabriele
  Speed'o'Meter 
  v 0.1-alpha
  https://github.com/gabbla/speedometer

## Library data of the parts
ANT1 = m310210:M310210
C1-C32 = rcl:C-EU: CAPACITOR, European symbol; SPICEPREFIX: C
IC1 = PIC32MX274F256DT-I_PT:PIC32MX274F256DT-I_PT: 32-bit Microcontrollers - MCU 256KB Flash, 64KB RAM, 10-Bit ADC, UART, SPI/I2S, I2C + VBATT Pin, USB Source: Datasheet <http://www.mouser.com/datasheet/2/268/60001404A-1113402.pdf>; ARROW_PART_NUMBER: PIC32MX274F256DT-I/PT; DESCRIPTION: 32-bit Microcontrollers - MCU 256KB Flash, 64KB RAM, 10-Bit ADC, UART, SPI/I2S, I2C + VBATT Pin, USB; HEIGHT: 1.2mm; MANUFACTURER_NAME: Microchip; MANUFACTURER_PART_NUMBER: PIC32MX274F256DT-I/PT
IC2 = SN65220DBVRG4:SN65220DBVRG4: ESD Suppressors / TVS Diodes Sngl Port Transient Suppressor Source: Datasheet <http://www.ti.com/lit/ds/symlink/sn75240.pdf>; ARROW_PART_NUMBER: SN65220DBVRG4; ARROW_PRICE/STOCK: https://www.arrow.com/en/products/sn65220dbvrg4/texas-instruments; DESCRIPTION: ESD Suppressors / TVS Diodes Sngl Port Transient Suppressor; HEIGHT: 1.45mm; MANUFACTURER_NAME: Texas Instruments; MANUFACTURER_PART_NUMBER: SN65220DBVRG4
IC3 IC8 = CSTCE12M0G15L99-R0:CSTCE12M0G15L99-R0: CSTCE12M0G15L99-R0, Ceramic Resonator, 12MHz Shear 33pF, 3-Pin SMT, 3.2 x 1.3 x 0.7mm Source: Datasheet <https://www.murata.com/~/media/webrenewal/support/library/catalog/products/timingdevice/ceralock/p16e.ashx>; ARROW_PART_NUMBER: CSTCE12M0G15L99-R0; ARROW_PRICE/STOCK: https://www.arrow.com/en/products/cstce12m0g15l99-r0/murata-manufacturing; DESCRIPTION: CSTCE12M0G15L99-R0, Ceramic Resonator, 12MHz Shear 33pF, 3-Pin SMT, 3.2 x 1.3 x 0.7mm; HEIGHT: mm; MANUFACTURER_NAME: Murata Electronics; MANUFACTURER_PART_NUMBER: CSTCE12M0G15L99-R0; RS_PART_NUMBER: 7926527P; RS_PRICE/STOCK: http://uk.rs-online.com/web/p/products/7926527P
IC4 = HM11:HM-11: JNHuaMao HM-11 Bluetooth 4.0 Transceiver based on TI CC2540/CC2541
IC5 = BQ27441DRZR-G1A:BQ27441DRZR-G1A: System-Side Impedance Track Battery Fuel (Gas) Gauge Source: Datasheet <http://www.ti.com/lit/gpn/bq27441-g1>; ARROW_PART_NUMBER: BQ27441DRZR-G1A; ARROW_PRICE-STOCK: https://www.arrow.com/en/products/bq27441drzr-g1a/texas-instruments; DESCRIPTION: System-Side Impedance Track Battery Fuel (Gas) Gauge; HEIGHT: mm; MANUFACTURER_NAME: Texas Instruments; MANUFACTURER_PART_NUMBER: BQ27441DRZR-G1A
IC6 = BQ24075RGTT:BQ24075RGTT: 1.5A Li-Ion Charger, Power-Path VQFN16EP BQ24075RGTT, Battery Charge Controller, Lithium-Ion, 4500mA, 16-Pin QFN Source: Datasheet <http://www.ti.com/lit/ds/symlink/bq24075.pdf>; ARROW_PART_NUMBER: BQ24075RGTT; ARROW_PRICE/STOCK: https://www.arrow.com/en/products/bq24075rgtt/texas-instruments; DESCRIPTION: 1.5A Li-Ion Charger, Power-Path VQFN16EP BQ24075RGTT, Battery Charge Controller, Lithium-Ion, 4500mA, 16-Pin QFN; HEIGHT: 0.8mm; MANUFACTURER_NAME: Texas Instruments; MANUFACTURER_PART_NUMBER: BQ24075RGTT; RS_PART_NUMBER: 8175815P; RS_PRICE/STOCK: http://uk.rs-online.com/web/p/products/8175815P
IC7 = nRF24L01P-T:NRF24L01P-T: RF Transceiver IC 2.4GHz ISM Band QFN20 Nordic Semiconductor NRF24L01P-T, RF Transceiver 2400MHz to 2483.5MHz 1.9 3.6 V 20-Pin QFN Source: Datasheet <http://www.nordicsemi.com/eng/content/download/2726/34069/file/nRF24L01P_Product_Specification_1_0.pdf>; ARROW_PART_NUMBER: nRF24L01P-T; ARROW_PRICE/STOCK: https://www.arrow.com/en/products/nrf24l01p-t/nordic-semiconductor; DESCRIPTION: RF Transceiver IC 2.4GHz ISM Band QFN20 Nordic Semiconductor NRF24L01P-T, RF Transceiver 2400MHz to 2483.5MHz 1.9 3.6 V 20-Pin QFN; HEIGHT: 0.95mm; MANUFACTURER_NAME: Nordic Semiconductor; MANUFACTURER_PART_NUMBER: nRF24L01P-T; RS_PART_NUMBER: 8855748P; RS_PRICE/STOCK: http://uk.rs-online.com/web/p/products/8855748P
IC9 = microchip:24*: Serial EEPROM I2C; MPN: 24LC024H-I/ST; OC_FARNELL: 1659745; OC_NEWARK: 77M3584
IC10 = MAX16054AZT+T:MAX16054AZT+T: On Off Controller, Debounce, 15kV ESD MAX16054AZT+T, Voltage Supervisor No Push Button Controller 6-Pin SOT-23 Source: Datasheet <http://docs-europe.electrocomponents.com/webdocs/1050/0900766b810509a1.pdf>; ARROW_PART_NUMBER: MAX16054AZT+T; ARROW_PRICE/STOCK: http://uk.rs-online.com/web/p/products/9237416; DESCRIPTION: On Off Controller, Debounce, 15kV ESD MAX16054AZT+T, Voltage Supervisor No Push Button Controller 6-Pin SOT-23; HEIGHT: 1.1mm; MANUFACTURER_NAME: Maxim Integrated; MANUFACTURER_PART_NUMBER: MAX16054AZT+T; RS_PART_NUMBER: 9237416; RS_PRICE/STOCK: http://uk.rs-online.com/web/p/products/9237416
IC11 IC12 = TPS63000DRCT:TPS63000DRCT: TPS63000DRCT Buck/Boost Converter, 1.2A, Adjustable, 1.2 5.5 V, 1500 kHz, 10-Pin SON EP Source: Datasheet <http://www.ti.com/lit/ds/symlink/tps63000.pdf>; ARROW_PART_NUMBER: TPS63000DRCT; ARROW_PRICE/STOCK: https://www.arrow.com/en/products/tps63000drct/texas-instruments; DESCRIPTION: TPS63000DRCT Buck/Boost Converter, 1.2A, Adjustable, 1.2 5.5 V, 1500 kHz, 10-Pin SON EP; HEIGHT: 1mm; MANUFACTURER_NAME: Texas Instruments; MANUFACTURER_PART_NUMBER: TPS63000DRCT; RS_PART_NUMBER: 0389334P; RS_PRICE/STOCK: http://uk.rs-online.com/web/p/products/0389334P
IC13 = 74LVC1G32SE:74LVC1G32SE-7
J1 = 10104111-0001LF:10104111-0001LF: FCI Right Angle SMT Female Type AB Version 2.0 Micro USB Connector, 100 V ac, 1.8A Source: Datasheet <http://uk.rs-online.com/web/p/products/1622014>; ALLIED_NUMBER: 70236825; DESCRIPTION: FCI Right Angle SMT Female Type AB Version 2.0 Micro USB Connector, 100 V ac, 1.8A; HEIGHT: mm; MANUFACTURER_NAME: FCI; MANUFACTURER_PART_NUMBER: 10104111-0001LF; RS_PART_NUMBER: 1622014
J2 = B2B-PH-SM4-TB(LF)(SN):B2B-PH-SM4-TB(LF)(SN): Wire-To-Board Connector, PH Series, 2 Contacts, Header, 2 mm, Surface Mount, 1 Rows Source: Datasheet <http://uk.rs-online.com/web/p/products/6881325P>; DESCRIPTION: Wire-To-Board Connector, PH Series, 2 Contacts, Header, 2 mm, Surface Mount, 1 Rows; HEIGHT: mm; MANUFACTURER_NAME: JST (JAPAN SOLDERLESS TERMINALS); MANUFACTURER_PART_NUMBER: B2B-PH-SM4-TB(LF)(SN); RS_PART_NUMBER: 6881325P
J3 = CONUFL001-SMD-T:CONUFL001-SMD-T: RF Connectors / Coaxial Connectors T&R U.FL Straight Surface Mount Jack Source: Datasheet <https://linxtechnologies.com/wp/product/mhf-rf-connectors/>; ARROW_PART_NUMBER: CONUFL001-SMD-T; DESCRIPTION: RF Connectors / Coaxial Connectors T&R U.FL Straight Surface Mount Jack; HEIGHT: mm; MANUFACTURER_NAME: Linx Technologies; MANUFACTURER_PART_NUMBER: CONUFL001-SMD-T
J4 = B4B-XH-A(LF)(SN):B4B-XH-A(LF)(SN): XH-2.5mm Header top entry 4 way JST XH Series, Series Number B4B, 2.5mm Pitch 4 Way 1 Row Straight PCB Header, Solder Termination, 3A Source: Datasheet <http://uk.rs-online.com/web/p/products/8201551>; ARROW_PART_NUMBER: B4B-XH-A(LF)(SN); ARROW_PRICE/STOCK: https://www.arrow.com/en/products/b4b-xh-a-lf-sn/jst-manufacturing; DESCRIPTION: XH-2.5mm Header top entry 4 way JST XH Series, Series Number B4B, 2.5mm Pitch 4 Way 1 Row Straight PCB Header, Solder Termination, 3A; HEIGHT: 7mm; MANUFACTURER_NAME: JST (JAPAN SOLDERLESS TERMINALS); MANUFACTURER_PART_NUMBER: B4B-XH-A(LF)(SN); RS_PART_NUMBER: 1724913; RS_PRICE/STOCK: http://uk.rs-online.com/web/p/products/1724913
J5 J7 = B2B-XH-A(LF)(SN):B2B-XH-A(LF)(SN): JST XH Series, 2.5mm Pitch 2 Way 1 Row Straight PCB Header, Solder Termination, 3A Source: Datasheet <http://docs-europe.electrocomponents.com/webdocs/1357/0900766b81357f2f.pdf>; ARROW_PART_NUMBER: B2B-XH-A(LF)(SN); ARROW_PRICE/STOCK: https://www.arrow.com/en/products/b2b-xh-a-lf-sn/jst-manufacturing; DESCRIPTION: JST XH Series, 2.5mm Pitch 2 Way 1 Row Straight PCB Header, Solder Termination, 3A; HEIGHT: 7mm; MANUFACTURER_NAME: JST (JAPAN SOLDERLESS TERMINALS); MANUFACTURER_PART_NUMBER: B2B-XH-A(LF)(SN); RS_PART_NUMBER: 1667312; RS_PRICE/STOCK: http://uk.rs-online.com/web/p/products/1667312
J6 = B4B-XH-A(LF)(SN):B4B-XH-A(LF)(SN): XH-2.5mm Header top entry 4 way JST XH Series, Series Number B4B, 2.5mm Pitch 4 Way 1 Row Straight PCB Header, Solder Termination, 3A Source: Datasheet <http://uk.rs-online.com/web/p/products/8201551>; ARROW_PART_NUMBER: B4B-XH-A(LF)(SN); ARROW_PRICE/STOCK: https://www.arrow.com/en/products/b4b-xh-a-lf-sn/jst-manufacturing; DESCRIPTION: XH-2.5mm Header top entry 4 way JST XH Series, Series Number B4B, 2.5mm Pitch 4 Way 1 Row Straight PCB Header, Solder Termination, 3A; HEIGHT: 7mm; MANUFACTURER_NAME: JST (JAPAN SOLDERLESS TERMINALS); MANUFACTURER_PART_NUMBER: B4B-XH-A(LF)(SN); RS_PART_NUMBER: 1724913; RS_PRICE/STOCK: http://uk.rs-online.com/web/p/products/1724913; SPICEPREFIX: E
JP1 = pinhead:PINHD-1X3: PIN HEADER
L1-L3 = 0402_inductor:INDUCTOR
L4 L5 = LPS3015-222MRB:LPS3015-222MRB: COILCRAFT - LPS3015-222MRB - INDUCTOR, SHLD, 2.2UH, 20%, 1.1A, SMD Source: Datasheet <https://www.coilcraft.com/misc/lps3015d.html>; ARROW_PART_NUMBER: LPS3015-222MRB; DESCRIPTION: COILCRAFT - LPS3015-222MRB - INDUCTOR, SHLD, 2.2UH, 20%, 1.1A, SMD; HEIGHT: mm; MANUFACTURER_NAME: COILCRAFT; MANUFACTURER_PART_NUMBER: LPS3015-222MRB; RS_PART_NUMBER: 644-1952
LED1-LED6 = led:LED: LED OSRAM: - CHIPLED LG R971, LG N971, LY N971, LG Q971, LY Q971, LO R971, LY R971 LH N974, LH R974 LS Q976, LO Q976, LY Q976 LO Q996 - Hyper CHIPLED LW Q18S LB Q993, LB Q99A, LB R99A - SideLED LS A670, LO A670, LY A670, LG A670, LP A670 LB A673, LV A673, LT A673, LW A673 LH A674 LY A675 LS A676, LA A676, LO A676, LY A676, LW A676 LS A679, LY A679, LG A679 - Hyper Micro SIDELED® LS Y876, LA Y876, LO Y876, LY Y876 LT Y87S - SmartLED LW L88C, LW L88S LB L89C, LB L89S, LG L890 LS L89K, LO L89K, LY L89K LS L896, LA L896, LO L896, LY L896 - TOPLED LS T670, LO T670, LY T670, LG T670, LP T670 LSG T670, LSP T670, LSY T670, LOP T670, LYG T670 LG T671, LOG T671, LSG T671 LB T673, LV T673, LT T673, LW T673 LH T674 LS T676, LA T676, LO T676, LY T676, LB T676, LH T676, LSB T676, LW T676 LB T67C, LV T67C, LT T67C, LS T67K, LO T67K, LY T67K, LW E67C LS E67B, LA E67B, LO E67B, LY E67B, LB E67C, LV E67C, LT E67C LW T67C LS T679, LY T679, LG T679 LS T770, LO T770, LY T770, LG T770, LP T770 LB T773, LV T773, LT T773, LW T773 LH T774 LS E675, LA E675, LY E675, LS T675 LS T776, LA T776, LO T776, LY T776, LB T776 LHGB T686 LT T68C, LB T68C - Hyper Mini TOPLED® LB M676 - Mini TOPLED Santana® LG M470 LS M47K, LO M47K, LY M47K Source: http://www.osram.convergy.de LUXEON: - LUMILED® LXK2-PW12-R00, LXK2-PW12-S00, LXK2-PW14-U00, LXK2-PW14-V00 LXK2-PM12-R00, LXK2-PM12-S00, LXK2-PM14-U00 LXK2-PE12-Q00, LXK2-PE12-R00, LXK2-PE12-S00, LXK2-PE14-T00, LXK2-PE14-U00 LXK2-PB12-K00, LXK2-PB12-L00, LXK2-PB12-M00, LXK2-PB14-N00, LXK2-PB14-P00, LXK2-PB14-Q00 LXK2-PR12-L00, LXK2-PR12-M00, LXK2-PR14-Q00, LXK2-PR14-R00 LXK2-PD12-Q00, LXK2-PD12-R00, LXK2-PD12-S00 LXK2-PH12-R00, LXK2-PH12-S00 LXK2-PL12-P00, LXK2-PL12-Q00, LXK2-PL12-R00 Source: www.luxeon.com KINGBRIGHT: KA-3528ASYC Source: www.kingbright.com
Q1-Q3 = transistor-npn:BC817*: NPN Transistor
Q4 = transistor-npn:BC817*: NPN Transistor; SPICEPREFIX: Q
R1-R10 R12-R17 R19-R22 R25-R36 = rcl:R-US_: RESISTOR, American symbol; SPICEPREFIX: R
R11 = rcl:R-US_: RESISTOR, American symbol; RS: 693-4381; SPICEPREFIX: R
R18 = rcl:R-US_: RESISTOR, American symbol; RS: 708-6111; SPICEPREFIX: R
R23 R24 = rcl:R-US_: RESISTOR, American symbol; RS_PART_NUMBER: 740-8978; SPICEPREFIX: R
S1 = PTS645VJM61LFS:PTS645VJM61LFS: Tactile Switches Tact Source: Datasheet <https://media.digikey.com/pdf/Data Sheets/C&K/PTS645VJzzz Series.pdf>; ARROW_PART_NUMBER: PTS645VJM61LFS; DESCRIPTION: Tactile Switches Tact; HEIGHT: 7mm; MANUFACTURER_NAME: C & K COMPONENTS; MANUFACTURER_PART_NUMBER: PTS645VJM61LFS
SV1 = con-lstb:MA06-1: PIN HEADER; OC_FARNELL: unknown; OC_NEWARK: unknown
TP1 = testpad:TP: Test pad; TP_SIGNAL_NAME: TP_SCL
TP2 = testpad:TP: Test pad; TP_SIGNAL_NAME: TP_SDA
TP3 = testpad:TP: Test pad; TP_SIGNAL_NAME: TP_SPI1_SDO
TP4 = testpad:TP: Test pad; TP_SIGNAL_NAME: TP_SPI1_SDI
TP5 = testpad:TP: Test pad; TP_SIGNAL_NAME: TP_NRF_IRQ
TP6 = testpad:TP: Test pad; TP_SIGNAL_NAME: TP_NRF_CS
TP7 = testpad:TP: Test pad; TP_SIGNAL_NAME: TP_SPI1_SCK
TP8 = testpad:TP: Test pad; TP_SIGNAL_NAME: TP_NRF_CE
TP9 = testpad:TP: Test pad; TP_SIGNAL_NAME: BT_TX
TP10 = testpad:TP: Test pad; TP_SIGNAL_NAME: BT_RX
TP11 = testpad:TP: Test pad; TP_SIGNAL_NAME: BT_RST
TP12 = testpad:TP: Test pad; TP_SIGNAL_NAME: BT_KEY
TP13 = testpad:TP: Test pad; TP_SIGNAL_NAME: TP_BAT
TP14 = testpad:TP: Test pad; TP_SIGNAL_NAME: TP_BAT2
TP15 = testpad:TP: Test pad; TP_SIGNAL_NAME: TP_VUSB
TP16 = testpad:TP: Test pad; TP_SIGNAL_NAME: TP_!PGOOD
TP17 = testpad:TP: Test pad; TP_SIGNAL_NAME: TP_!CHG
TP18 = testpad:TP: Test pad; TP_SIGNAL_NAME: TP_GND
TP19 = testpad:TP: Test pad; TP_SIGNAL_NAME: TP_VCCINT
TP20 = testpad:TP: Test pad; TP_SIGNAL_NAME: TP_SYS_EN_PIC
TP21 = testpad:TP: Test pad; TP_SIGNAL_NAME: TP_SYS_EN_MAX
TP22 = testpad:TP: Test pad; TP_SIGNAL_NAME: TP_3V3
TP23 = testpad:TP: Test pad; TP_SIGNAL_NAME: TP_5V
TP24 = testpad:TP: Test pad; TP_SIGNAL_NAME: TP_SYS_EN
TP25 TP26 = testpad:TP: Test pad; TP_SIGNAL_NAME: TP_L_DX
U1 U2 = SN74AHC1G08DBVR:SN74AHC1G08DBVR: Texas Instruments SN74AHC1G08DBVR, 2-Input AND Logic Gate, 2 5.5 V, 5-Pin SOT-23 Source: Datasheet <http://www.ti.com/general/docs/lit/getliterature.tsp?genericPartNumber=SN74AHC1G08&&fileType=pdf>; ARROW_PART_NUMBER: SN74AHC1G08DBVR; ARROW_PRICE-STOCK: https://www.arrow.com/en/products/sn74ahc1g08dbvr/texas-instruments; DESCRIPTION: Texas Instruments SN74AHC1G08DBVR, 2-Input AND Logic Gate, 2 5.5 V, 5-Pin SOT-23; HEIGHT: 1.45mm; MANUFACTURER_NAME: Texas Instruments; MANUFACTURER_PART_NUMBER: SN74AHC1G08DBVR; RS_PART_NUMBER: 1218343; RS_PRICE-STOCK: http://uk.rs-online.com/web/p/products/1218343
X1 X2 = con-samtec:TSW-102-*-G-S: THROUGH-HOLE .025" SQ POST HEADER Source: Samtec TSW.pdf; MF: Samtec Inc.; MPN: TSW-102-07-G-S

## Net classes
1 antenna: clearance 0.152 mm

## Board
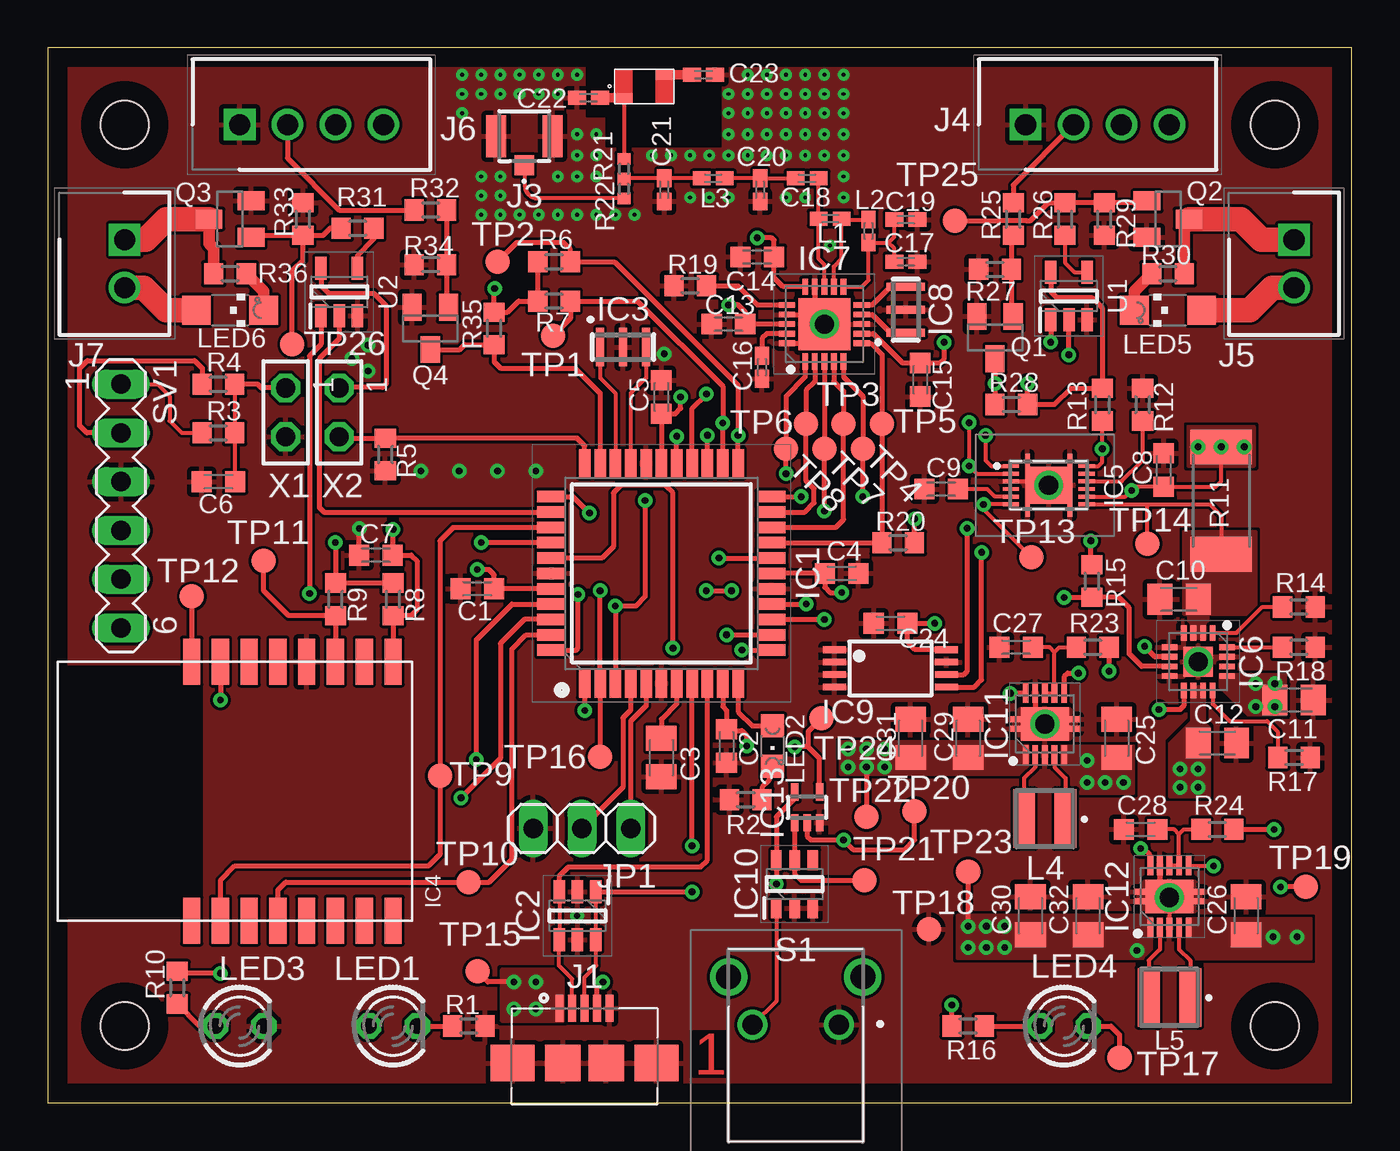
[diagram p7: board, top side]
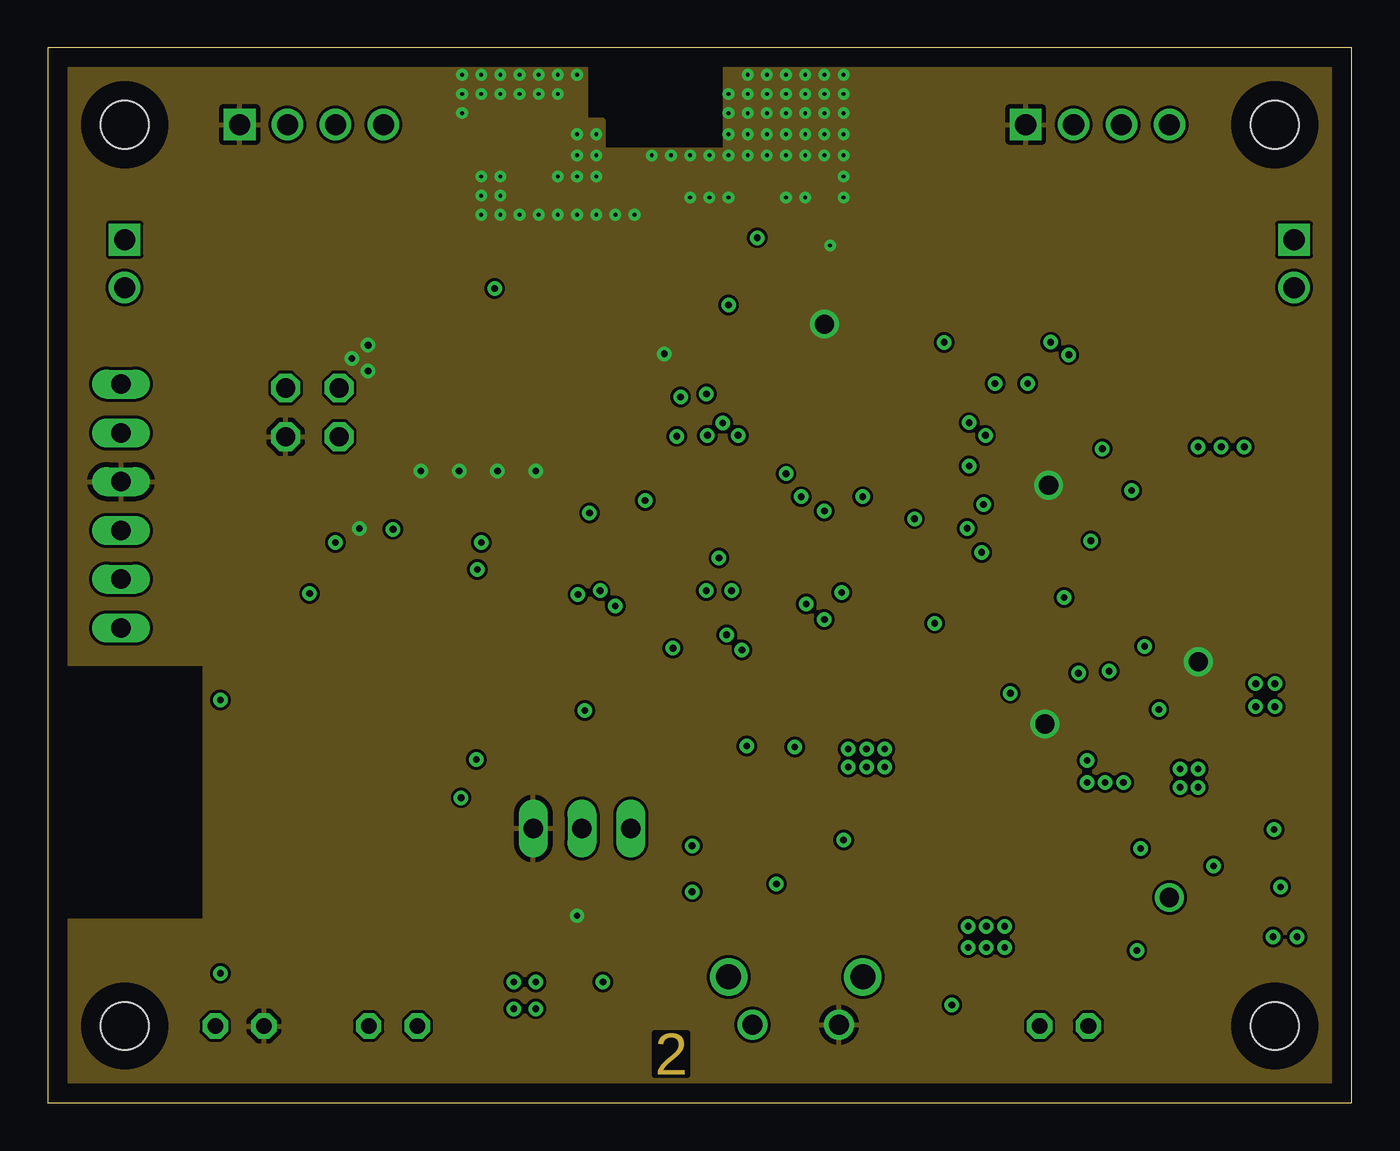
[diagram p8: board, inner layer Route2]
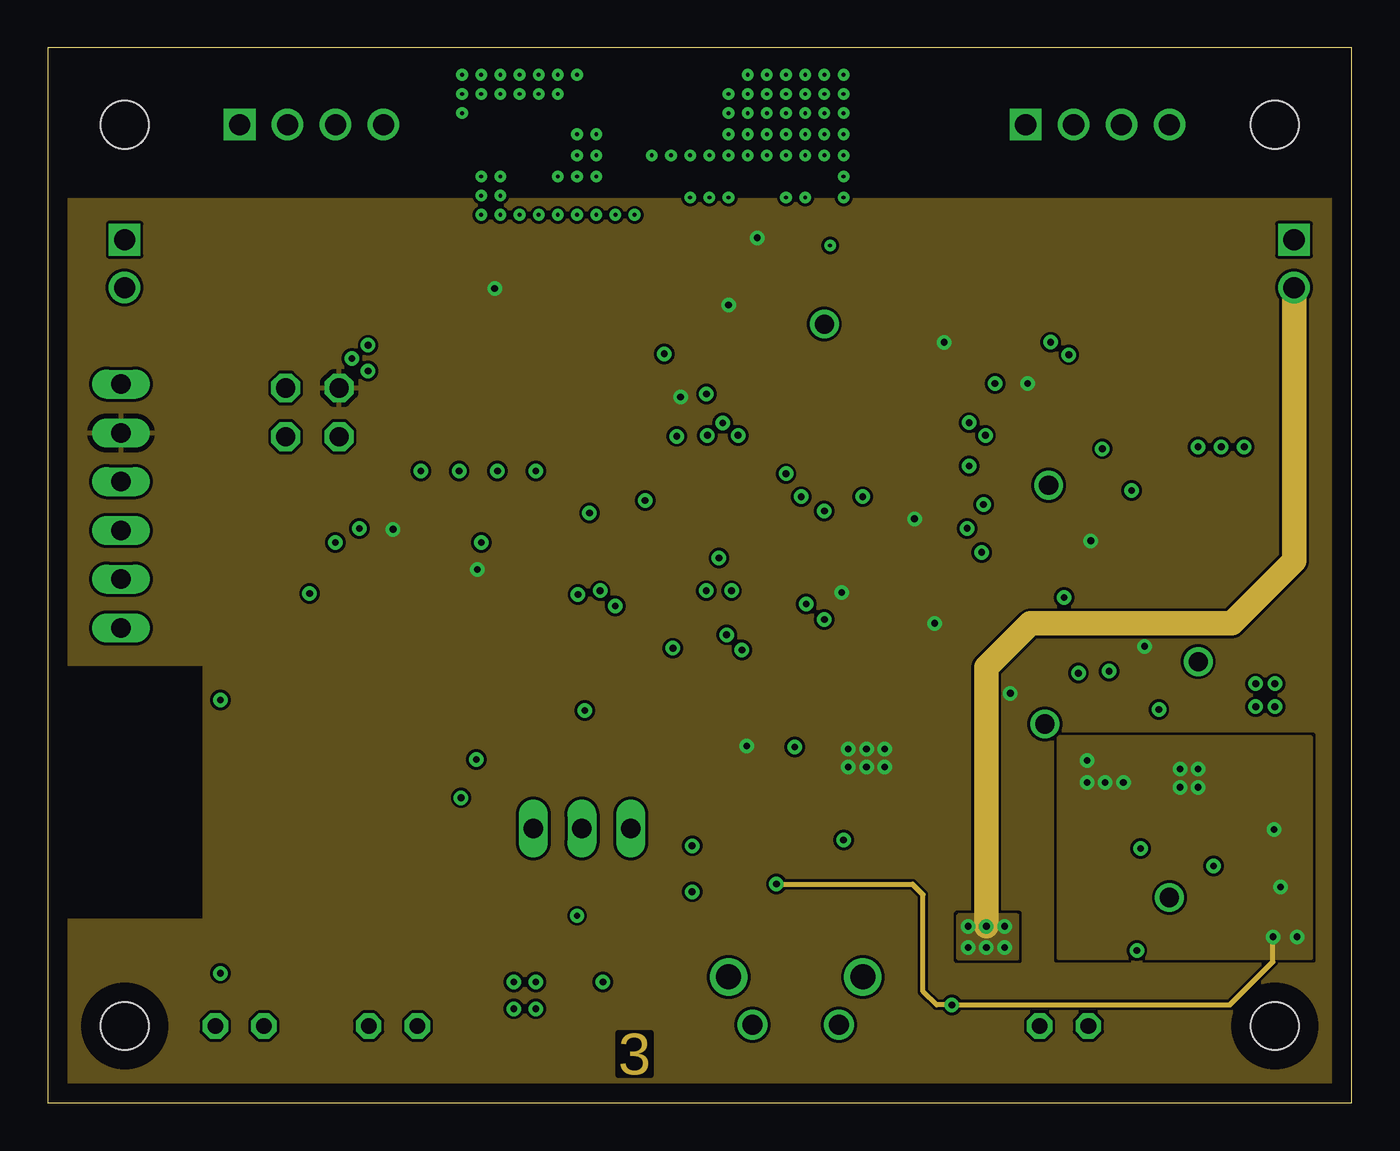
[diagram p9: board, inner layer Route15]
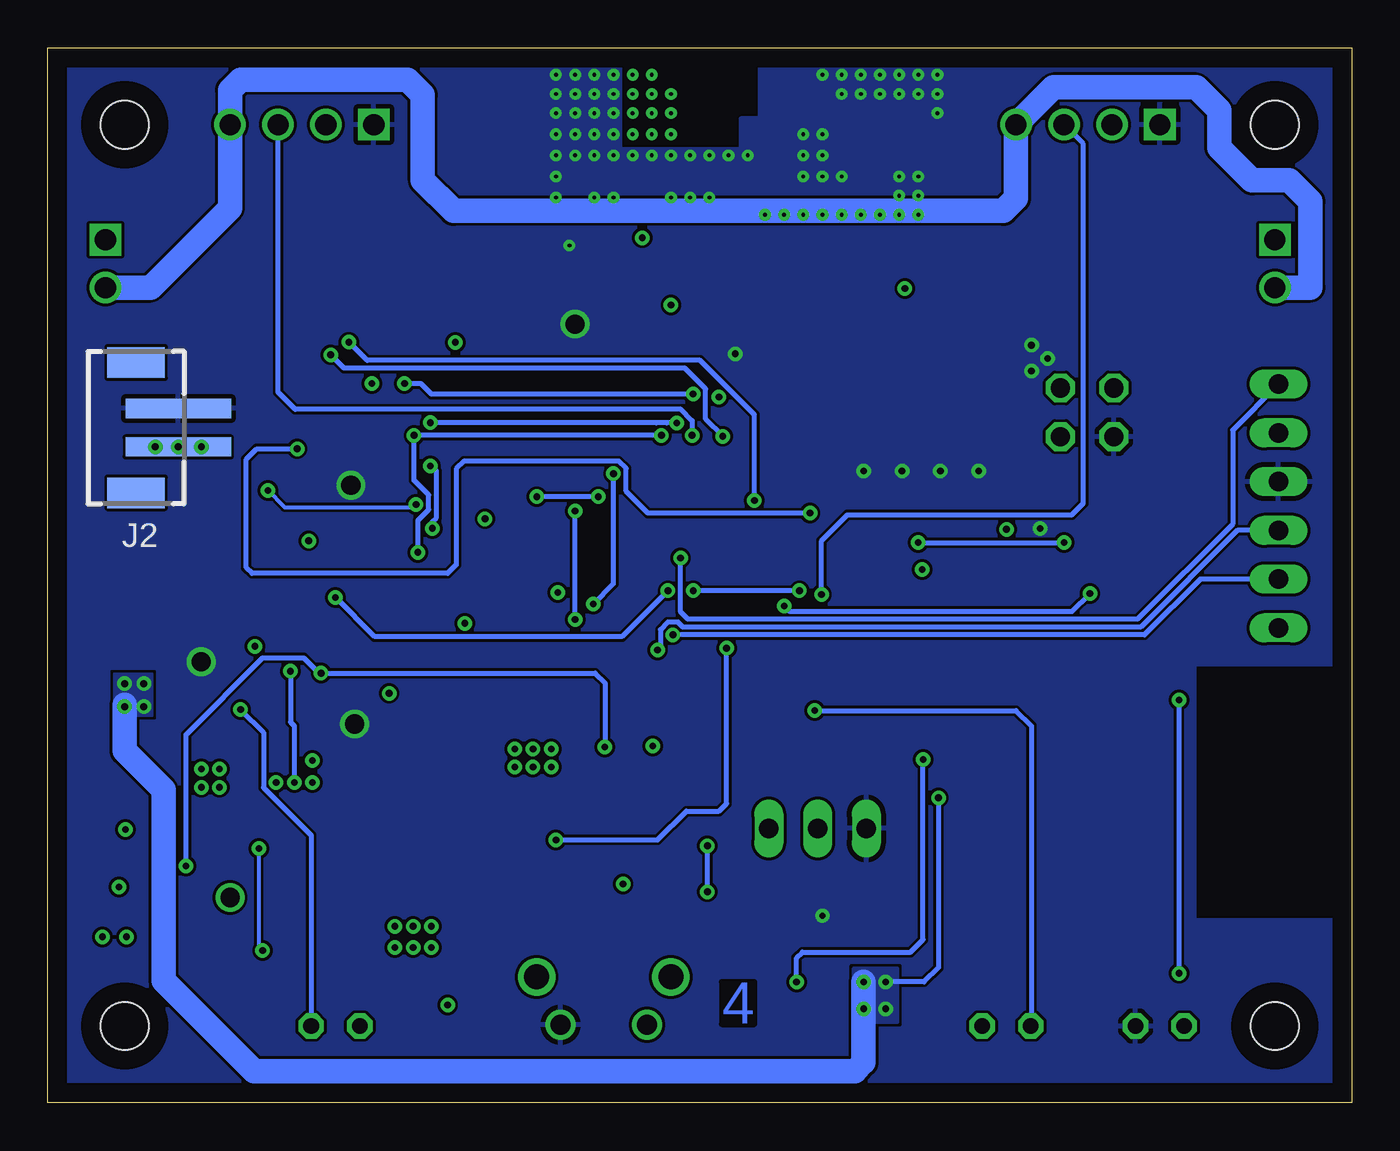
[diagram p10: board, bottom side, seen from below]

Size 68 x 55 mm. Coordinates in mm from the lower left corner, seen from the top.
Outline: 0,0 68,0 68,55 0,55 0,0
Copper layers (1+2*15+16): Top 0.035mm / dielectric 0.1mm / Route2 0.0175mm / dielectric 1.265mm / Route15 0.0175mm / dielectric 0.1mm / Bottom 0.035mm
Design rules "default *": minimum track width 6mil, minimum drill 0.2mm, track to track 6mil, track to pad 6mil, pad to pad 6mil, via to via 6mil, smd to smd 6mil, copper to edge 40mil, drill to drill 6mil, minimum pad ring 10mil, minimum via ring 8mil, stop-mask expansion 4mil, vias tented up to drill 0mil, thermal gap 10mil
Holes 2.5 mm at 4,51 64,51 64,4 4,4

### Footprints (pad centres in the part's own frame; a part is rotated, then mirrored left to right if it is on the bottom)
M310210 = smd 0.9 x 0.5: P$1 -1.05,-0.6; P$2 1.05,0.6
C0603K = smd 1.05 x 1.08: 1 -0.875,0; 2 0.875,0
C0805K = smd 1.3 x 1.6: 1 -1,0; 2 1,0
C0402K = smd 0.925 x 0.74: 1 -0.6,0; 2 0.6,0
QFP80P1200X1200X120-44N = smd 1.475 x 0.6: 1 -5.738,4; 2 -5.738,3.2; 3 -5.738,2.4; 4 -5.738,1.6; 5 -5.738,0.8; 6 -5.738,0; 7 -5.738,-0.8; 8 -5.738,-1.6; 9 -5.738,-2.4; 10 -5.738,-3.2; 11 -5.738,-4; 23 5.738,-4; 24 5.738,-3.2; 25 5.738,-2.4; 26 5.738,-1.6; 27 5.738,-0.8; 28 5.738,0; 29 5.738,0.8; 30 5.738,1.6; 31 5.738,2.4; 32 5.738,3.2; 33 5.738,4 | smd 0.6 x 1.475: 12 -4,-5.738; 13 -3.2,-5.738; 14 -2.4,-5.738; 15 -1.6,-5.738; 16 -0.8,-5.738; 17 0,-5.738; 18 0.8,-5.738; 19 1.6,-5.738; 20 2.4,-5.738; 21 3.2,-5.738; 22 4,-5.738; 34 4,5.738; 35 3.2,5.738; 36 2.4,5.738; 37 1.6,5.738; 38 0.8,5.738; 39 0,5.738; 40 -0.8,5.738; 41 -1.6,5.738; 42 -2.4,5.738; 43 -3.2,5.738; 44 -4,5.738
SOT95P280X145-6N = smd 1.2 x 0.6: 1 -1.25,0.95; 2 -1.25,0; 3 -1.25,-0.95; 4 1.25,-0.95; 5 1.25,0; 6 1.25,0.95
CSTCE_G = smd 0.4 x 2: 1 1.2,0; 2 0,0; 3 -1.2,0
HM-11 = smd 2.4 x 0.9: GND 6.5,0; NC@5 -7,0; NC@6 -7,-1.5; NC@7 -7,-3; NC@8 -7,-4.5; NC@10 6.5,-3; PIO0 6.5,6; PIO1 6.5,4.5; PIO2 6.5,3; PIO3 6.5,1.5; RESETB 6.5,-1.5; UART_CTS -7,3; UART_RTS -7,6; UART_RX -7,1.5; UART_TX -7,4.5; VCC 6.5,-4.5
BQ27441DRZRG1A = smd 0.2 x 0.85: 1 -1,-1.975; 2 -0.6,-1.975; 3 -0.2,-1.975; 4 0.2,-1.975; 5 0.6,-1.975; 6 1,-1.975; 7 1,1.975; 8 0.6,1.975; 9 0.2,1.975; 10 -0.2,1.975; 11 -0.6,1.975; 12 -1,1.975 | smd 1.95 x 1.95: 13 0,0 | smd 3.3 x 0.25: 14 0,1.1; 15 0,-1.1
QFN50P300X300X80-17N = smd 0.8 x 0.3: 1 -1.5,0.75; 2 -1.5,0.25; 3 -1.5,-0.25; 4 -1.5,-0.75; 9 1.5,-0.75; 10 1.5,-0.25; 11 1.5,0.25; 12 1.5,0.75 | smd 0.3 x 0.8: 5 -0.75,-1.5; 6 -0.25,-1.5; 7 0.25,-1.5; 8 0.75,-1.5; 13 0.75,1.5; 14 0.25,1.5; 15 -0.25,1.5; 16 -0.75,1.5 | smd 1.55 x 1.55: 17 0,0
QFN50P400X400X95-21N = smd 0.85 x 0.3: 1 -1.95,1; 2 -1.95,0.5; 3 -1.95,0; 4 -1.95,-0.5; 5 -1.95,-1; 11 1.95,-1; 12 1.95,-0.5; 13 1.95,0; 14 1.95,0.5; 15 1.95,1 | smd 0.3 x 0.85: 6 -1,-1.95; 7 -0.5,-1.95; 8 0,-1.95; 9 0.5,-1.95; 10 1,-1.95; 16 1,1.95; 17 0.5,1.95; 18 0,1.95; 19 -0.5,1.95; 20 -1,1.95 | smd 2.7 x 2.7: 21 0,0
TSSOP8 = smd 0.35 x 1.2: 1 -0.975,-2.925; 2 -0.325,-2.925; 3 0.325,-2.925; 4 0.975,-2.925; 5 0.975,2.925; 6 0.325,2.925; 7 -0.325,2.925; 8 -0.975,2.925
SOT95P275X110-6N = smd 1.05 x 0.55: 1 -1.25,0.95; 2 -1.25,0; 3 -1.25,-0.95; 4 1.25,-0.95; 5 1.25,0; 6 1.25,0.95
SON50P300X300X100-11N = smd 1 x 0.3: 1 -1.6,1; 2 -1.6,0.5; 3 -1.6,0; 4 -1.6,-0.5; 5 -1.6,-1; 6 1.6,-1; 7 1.6,-0.5; 8 1.6,0; 9 1.6,0.5; 10 1.6,1 | smd 1.75 x 2.5: 11 0,0 | smd 0.3 x 1: EP1 -0.25,1.3; EP2 0.25,1.3; EP3 -0.25,-1.3; EP4 0.25,-1.3
SOT353 = smd 0.4 x 0.9: 1 -0.65,-0.8; 2 0,-0.8; 3 0.65,-0.8; 4 0.65,0.8; 5 -0.65,0.8
MICRO_USB_A/B_TYPE_RECEPTACLE = smd 0.4 x 1.4: 1 -1.31,-0.08; 2 -0.66,-0.08; 3 -0.01,-0.08; 4 0.64,-0.08; 5 1.29,-0.08 | smd 2.3 x 1.9: 6 3.74,-2.93; 7 -3.76,-2.93 | smd 1.85 x 1.9: 8 1.115,-2.93; 9 -1.135,-2.93
B2B-PH-SM4-TB = smd 1 x 5.5: 1 -1,0; 2 1,0 | smd 1.6 x 3: 3 -3.4,-2.2; 4 3.4,-2.2
CONUFL001-SMD = smd 1 x 1.05: 1 0,-1.525 | smd 1.05 x 2.2: 2 -1.475,0; 3 1.475,0
SHDR4W64P0X250_1X4_1240X575X70 = drill 1.1 pad 1.65 square: 1 0,0 | drill 1.1 pad 1.65: 2 2.5,0; 3 5,0; 4 7.5,0
SHDR2W64P0X250_1X2_740X575X700 = drill 1.1 pad 1.65 square: 1 0,0 | drill 1.1 pad 1.65: 2 2.5,0
1X03 = drill 1.016 long: 1 -2.54,0; 2 0,0; 3 2.54,0
LPS3015 = smd 1.14 x 3.05: 1 -1.08,0; 2 1.08,0
LED3MM = drill 0.813 octagon: A -1.27,0; K 1.27,0
CHIPLED_0805 = smd 1.2 x 1.2: A 0,-1.05; C 0,1.05
CHIPLED_1206 = smd 1.5 x 1.5: A 0,-1.75; C 0,1.75
SOT23-BEC = smd 1 x 1.4: B -0.95,-1.1; C 0,1.1; E 0.95,-1.1
R0603 = smd 1 x 1.1: 1 -0.85,0; 2 0.85,0
R2512 = smd 1.8 x 3.2: 1 -2.8,0; 2 2.8,0
R0402 = smd 0.6 x 0.7: 1 -0.5,0; 2 0.5,0
PTS645VJM61LFS = drill 1.05 pad 1.575: 1 -2.258,-0.059; 2 2.242,-0.059 | drill 1.3 pad 1.95: 3 -3.508,-2.559; 4 3.492,-2.559
MA06-1 = drill 1.016 long: 1 -6.35,0; 2 -3.81,0; 3 -1.27,0; 4 1.27,0; 5 3.81,0; 6 6.35,0
B1,27 = smd 1.27 x 1.27: TP 0,0
SOT95P280X145-5N = smd 1.2 x 0.6: 1 -1.25,0.95; 2 -1.25,0; 3 -1.25,-0.95; 4 1.25,-0.95; 5 1.25,0.95
TSW-102-XX-G-S = drill 1 pad 1.5 octagon: 1 1.27,0; 2 -1.27,0

### Placement (x,y rotation side)
ANT1  31.1,53 0 top
C1  22.4,26.8 180 top
C2  35.4,18.6 270 top
C3  32,18 270 top
C4  41.4,27.6 0 top
C5  32,36.8 90 top
C6  8.89,32.38 180 top
C7  17.1,28.55 180 top
C8  58.2,33 90 top
C9  46.6,32 180 top
C10  59,26.25 180 top
C11  65,21 0 top
C12  61,18.75 0 top
C13  35.5,40.6 180 top
C14  37,44.1 180 top
C15  45.5,37.7 270 top
C16  37.25,38.35 270 top
C17  44.75,43.85 0 top
C18  39.6,48.2 180 top
C19  44.75,46.05 0 top
C20  37.15,47.6 270 top
C21  32.15,47.6 270 top
C22  28.2,52.4 180 top
C23  34.2,53.6 0 top
C24  43.95,25 180 top
C25  55.75,19 90 top
C26  62.5,9.75 90 top
C27  50.5,23.75 180 top
C28  57,14.25 180 top
C29  48,19 90 top
C30  51.25,9.75 90 top
C31  45,19 90 top
C32  54.25,9.75 90 top
IC1  32,27.6 90 top
IC2  27.62,9.75 270 top
IC3  30,39.4 180 top
IC4  13.5,16.5 90 top
IC5  52.2,32.2 270 top
IC6  60,23 270 top
IC7  40.5,40.6 90 top
IC8  44.75,41.35 270 top
IC9  43.95,22.65 270 top
IC10  38.95,11.4 90 top
IC11  52,19.75 90 top
IC12  58.5,10.75 90 top
IC13  39.6,15.4 0 top
J1  28,5 0 top
J2  61.2,35.2 270 bottom
J3  24.85,50.4 0 top
J4  51,51 0 top
J5  65,45 270 top
J6  10,51 0 top
J7  4,45 270 top
JP1  27.85,14.3 180 top
L1  40.8,46.1 0 top
L2  42.8,45.45 270 top
L3  34.7,48.2 180 top
L4  52,14.81 180 top
L5  58.5,5.5 180 top
LED1  18,4 0 top
LED2  37.8,18.6 180 top
LED3  10,4 0 top
LED4  53,4 0 top
LED5  58.42,41.33 90 top
LED6  9.5,41.33 270 top
Q1  49.4,39.9 180 top
Q2  58.42,46.08 270 top
Q3  9.5,46.08 90 top
Q4  19.95,40.38 180 top
R1  21.95,4 0 top
R2  36.4,15.8 180 top
R3  8.89,34.92 0 top
R4  8.89,37.47 180 top
R5  17.6,33.8 90 top
R6  26.4,43.85 180 top
R7  26.4,41.8 180 top
R8  18,26.25 270 top
R9  15,26.25 270 top
R10  6.75,6 270 top
R11  61.2,31.4 270 top
R12  57.1,36.4 270 top
R13  55,36.4 90 top
R14  65.25,25.85 180 top
R15  54.45,27.2 270 top
R16  48,4 0 top
R17  65,18 180 top
R18  65.25,23.75 180 top
R19  33.5,42.6 180 top
R20  44.35,29.2 0 top
R21  30.05,48.7 90 top
R22  30.05,47.65 270 top
R23  54.5,23.75 0 top
R24  61,14.25 0 top
R25  50.35,46.08 270 top
R26  53.05,46.08 90 top
R27  49.4,43.45 180 top
R28  50.25,36.41 0 top
R29  55.1,46.08 270 top
R30  58.42,43.23 180 top
R31  16.15,45.6 180 top
R32  19.95,46.55 0 top
R33  13.3,46.08 90 top
R34  19.95,43.7 180 top
R35  23.27,40.38 90 top
R36  9.5,43.23 0 top
S1  39,4 180 top
SV1  3.81,31.11 270 top
TP1  26.35,40 0 top
TP2  23.45,43.85 0 top
TP3  41.5,35.4 0 top
TP4  42.5,34.1 0 top
TP5  43.5,35.4 0 top
TP6  39.55,35.4 0 top
TP7  40.5,34.1 0 top
TP8  38.5,34.1 0 top
TP9  20.45,17.05 0 top
TP10  21.95,11.5 0 top
TP11  11.25,28.25 0 top
TP12  7.5,26.4 0 top
TP13  51.3,28.45 0 top
TP14  57.35,29.15 0 top
TP15  22.4,6.85 0 top
TP16  28.8,18.05 0 top
TP17  55.9,2.35 0 top
TP18  45.95,9.05 0 top
TP19  65.6,11.25 0 top
TP20  45.2,15.2 0 top
TP21  42.6,11.6 0 top
TP22  42.7,14.9 0 top
TP23  48,12.05 0 top
TP24  40.35,20.05 0 top
TP25  47.3,46 0 top
TP26  12.75,39.55 0 top
U1  53.26,42.06 90 top
U2  15.2,42.27 90 top
X1  12.4,36 90 top
X2  15.19,36 90 top

### Tracks (layer width: path | path; a pad name or v marks a point on that pad's centre or on a via)
!BAT_CHG  (via drill 0.35)
  Top 0.254: LED4.K 55.45,4 55.9,3.55 TP17.TP | IC6.9 59.25,20.7 59.05,20.5 v57.95,20.5
  Bottom 0.254: v57.95,20.5 56.76,19.31 56.76,16.43 54.27,13.94 LED4.K
!MCLR  (via drill 0.35)
  Top 0.203: SV1.1 5.71,37.47 6.35,36.83 6.35,35.56 6.99,34.92 R3.1
  Top 0.254: v35,28.4 IC1.18
  Bottom 0.254: SV1.1 6.2,35.08 6.2,30.18 11.16,25.21 34.61,25.21 35,25.6 v35,28.4
+3V3  (via drill 0.35)
  Top 0.203: C5.1 31.93,36
  Top 0.254: IC1.28 C5.1 32.73,35.92 33,36.2 v33,36.8 | IC1.40 C1.1 23.27,27.52 23,27.8 v22.4,27.8 | IC1.17 C4.1 40.52,26.88 40.8,26.6 v41.4,26.6 | IC7.18 C13.1 36.38,41.23 36,41.6 v35.5,41.6 | v37,45.1 37.75,45.1 37.88,44.98 C14.1 37.88,43.02 38.35,42.55 IC7.15 | IC4.VCC R8.2 18.95,25.4 19.25,25.7 19.25,28.25 18.95,28.55 C7.1 18,28.57 v18,29.9 | IC1.10 35.2,20.65 35.4,20.45 C2.1 35.48,19.4 36.2,19.4 36.45,19.15 v36.45,18.6 | IC9.8 45.23,23.62 44.83,24.02 C24.1 v46.25,25 | v42.7,17.5 TP22.TP | U2.5 14.25,42.6 14.65,42.2 17,42.2 17.65,41.55 17.65,37.5 17.45,37.3 15.22,37.3 X2.1 | SV1.2 2.02,34.92 1.65,35.3 1.65,38.3 2.05,38.7 7.65,38.7 8.05,38.3 8.04,38.29 R4.2 | IC11.10 v50.2,21.35 | IC6.6 57.75,23.25 v57.2,23.8 | R15.1 54.4,28.1 v54.4,29.3 | R20.2 v45.2,30.45 | R6.2 R7.2 24.55,41.8 23.98,41.23 R35.2 23.27,42.42 v23.3,42.45 | IC7.7 43.05,40.1 44.58,38.58 C15.1 46.52,38.58 46.75,38.8 v46.75,39.65 | U1.5 52.3,42.3 52.6,42 54.45,42 55,41.45 R13.2 53.35,37.25 52.51,36.41 R28.2 v51.1,37.5
  other vias: 41.75,18.45 42.7,18.45 41.75,17.5 43.65,17.5 43.65,18.45
  pour Top (no thermals): 51.15,18.85 51.15,17.1 41.35,17.1 41.35,18.85
  pour Route15 (rank 3): 0.05,47.05 68,47.05 68,0.05 0,0.05 0,9.5 8.2,9.5 8.2,22.9 0,22.9 0,23
+5V  (via drill 0.35)
  Top 0.254: TP23.TP v48,9.2 | IC12.10 57.5,12.9 57.15,13.25 v57,13.25
  Top 1.27: J7.2 5,42.5 6.17,41.33 LED6.A | J5.2 63.88,42.5 62.7,41.33 LED5.A
  Route15 1.27: v48.95,9.2 48.95,22.7 51.25,25 61.75,25 65,28.25 J5.2
  Bottom 0.2: v57,13.25 57,8.15 v56.8,7.95 v56.8,7.94
  Bottom 1.27: J7.2 2.15,42.5 2.15,47 3.25,48.1 5.2,48.1 6.9,49.8 6.9,51.75 8.1,52.95 15.55,52.95 J6.4 17.5,47.15 18.15,46.5 46.85,46.5 48.45,48.1 48.45,52.55 49.25,53.35 57.95,53.35 58.5,52.8 J4.4 58.5,46.65 62.65,42.5 J5.2
  other vias: 48.95,8.1 49.9,9.2 48,8.1 49.9,8.1
  pour Top (no thermals): 57.55,9.8 57.55,7.5 47.45,7.5 47.45,9.8
  pour Route15 (no thermals): 47.5,9.75 47.5,7.55 50.55,7.55 50.55,9.75
_VBAT  (via drill 0.35)
  Top 0.2: TP13.TP 48.85,30.9 48.85,31.2
  Top 0.203: IC5.8 56.2,31.6 v56.52,31.93 56.73,32.12 C8.1 60.92,32.12 61.2,32.4 J2.2 | IC5.6 48.85,31.2 v48.8,31.2
  Bottom 0.203: v48.8,31.2 48.95,31.05 55.65,31.05 v56.52,31.93
  other vias: 61.2,34.2 60,34.2 62.4,34.2
  pour Top (no thermals): 59.5,35.25 62.9,35.25 62.9,33.2 59.5,33.2
BL_TRIG
  Top 0.254: X2.2 15.27,34.65 R5.2 27.6,34.65 28,34.25 IC1.33
BQ_1V8
  Top 0.203: C9.1 49,32 49.4,31.6 IC5.5
BQ_PGOOD  (via drill 0.35)
  Top 0.254: IC6.7 57.05,22.75 56.4,23.4 56.4,25.8 55.85,26.35 R15.2 v53,26.35 | v28.8,26.7 IC1.2 TP16.TP | v34.34,26.7 v35.66,26.7
  Bottom 0.254: v35.66,26.7 38.06,24.3 50.95,24.3 v53,26.35 | v28.8,26.7 v34.34,26.7
BT_RST  (via drill 0.35)
  Top 0.254: R8.1 R9.1 v15,29.21 | v22.6,29.21 v22.61,29.2 IC1.37
  Bottom 0.254: v22.6,29.21 v15.01,29.21 v15,29.2 v15,29.21
CTL_L
  Top 0.254: U2.2 15.2,39.83 14.16,38.78 14.16,31.04 14.4,30.8 IC1.35
CTL_R  (via drill 0.35)
  Top 0.254: v53.25,39 U1.2 | IC1.27 v32.8,34.75
  Bottom 0.254: v32.8,34.75 33.69,35.64 33.69,37.22 34.77,38.3 52.55,38.3 v53.25,39
GAUGE_GP  (via drill 0.35)
  Top 0.203: IC5.12 54.8,33.2 55,33.4 v55,34.1 R13.1
  Top 0.254: IC1.34 27.4,31.6 v28.25,30.75
  Bottom 0.254: v28.25,30.75 36.7,30.75 37.84,31.89 37.84,33.07 38.23,33.46 46.29,33.46 46.7,33.05 46.7,28.05 47.15,27.6 57.35,27.6 57.65,27.9 57.65,33.55 57.1,34.1 v55,34.1
GND  (via drill 0.2, 0.3, 0.35, 1)
  Top 0.2: IC5.3 51.1,32.4 IC5.15 | IC12.11 IC12.3
  Top 0.254: C7.2 16.23,29.94 v16.25,29.94 | IC7.20 39.5,39.6 IC7.21 40,41.1 | IC7.17 40,41.1 | IC7.14 40,41.1 | IC12.9 58,11.25 IC12.11 | IC12.EP2 58.25,11 IC12.11 | IC12.EP1 58.25,10.5 IC12.11 | IC12.EP3 58.75,10.5 IC12.11 | IC12.EP4 58.5,11 IC12.11 | IC11.9 51.5,20 | 51.5,20 51.5,19.75 | 51.5,19.75 IC11.11 | IC11.EP2 51.5,20 | IC11.EP1 51.5,19.5 51.5,19.75 | IC11.EP3 52,19.5 IC11.11 | IC11.EP4 52,20 IC11.11
  other vias: 60,23 52.2,32.2 40.5,40.6 16.7,39.5 15.85,38.8 16.7,38.15 32.15,39.05 52,19.75 27.6,9.75 35.5,52.6 36.5,53.6 37.5,53.6 38.5,53.6 39.5,53.6 40.5,53.6 41.5,53.6 31.5,49.4 32.5,49.4 33.5,49.4 34.5,49.4 35.5,49.4 36.5,49.4 36.5,51.6 37.5,51.6 38.5,51.6 39.5,51.6 40.5,51.6 41.5,51.6 36.5,52.6 37.5,52.6 38.5,52.6 39.5,52.6 40.5,52.6 41.5,52.6 36.5,50.5 37.5,50.5 38.5,50.5 39.5,50.5 40.5,50.5 41.5,50.5 35.5,50.5 35.5,51.6 37.5,49.4 38.5,49.4 39.5,49.4 40.5,49.4 41.5,49.4 33.5,47.2 34.5,47.2 35.5,47.2 38.5,47.2 39.5,47.2 41.5,47.2 41.5,48.3 22.6,53.6 23.6,53.6 24.6,53.6 25.6,53.6 26.6,53.6 27.6,53.6 21.6,53.6 22.6,52.6 23.6,52.6 24.6,52.6 25.6,52.6 26.6,52.6 21.6,52.6 21.6,51.6 27.6,50.5 28.6,50.5 27.6,49.4 28.6,49.4 23.6,48.3 26.6,48.3 27.6,48.3 28.6,48.3 22.6,48.3 26.6,46.3 27.6,46.3 28.6,46.3 29.6,46.3 30.6,46.3 25.6,46.3 23.6,47.3 22.6,47.3 22.6,46.3 23.6,46.3 24.6,46.3 19.45,32.94 21.45,32.94 23.45,32.94 25.45,32.94 40.8,44.7
  pour Route2: 0,55 28.05,55 28.05,51.25 28.95,51.25 28.95,49.7 35.35,49.7 35.35,54.95 67.95,54.95 67.95,0 0,0 0,9.5 8.2,9.5 8.2,22.9 0,22.9
  pour Bottom (rank 6): 0.05,55 30.85,55 30.85,51.3 31.85,51.3 31.85,49.7 38.15,49.7 38.15,54.95 68,54.95 68,0.05 0,0.05 0,9.5 8.2,9.5 8.2,22.9 0,22.9 0,23.1
  pour Top (rank 6): -0.1,55 67.95,55 67.95,0.05 0.1,0.05 0.1,9.5 8.2,9.5 8.2,22.9 0,22.9 0,23.1
I2C2_SCL  (via drill 0.35)
  Top 0.2: v48.05,35.46 v48.05,33.2 48.45,32.8 IC5.2
  Top 0.254: IC1.24 v35.2,35.45 35.2,37.35 30.75,41.8 R7.1 27.25,40.9 TP1.TP | IC9.6 47.77,22.32 47.95,22.5 v47.95,29.95
  Bottom 0.254: v35.2,35.45 35.72,35.45 35.73,35.46 36.27,35.46 36.28,35.45 v48.04,35.45 v48.05,35.46 | v47.95,29.95 47.95,30.3 47.74,30.51 47.74,32.94 48.05,33.25 v48.05,33.2
I2C2_SDA  (via drill 0.35)
  Top 0.2: IC5.1 49.2,33.2 48.9,33.5 v48.9,34.8
  Top 0.254: IC1.23 v36,34.8 36,37.4 29.55,43.85 R6.1 27.25,44.5 26.9,44.85 24.45,44.85 TP2.TP | IC9.5 48.33,21.68 48.7,22.05 v48.7,28.7
  Bottom 0.254: v36,34.8 v48.9,34.8 48.9,32.45 48.14,31.69 48.14,30.93 48.7,30.37 v48.7,28.7
IN_L
  Top 0.254: IC1.32 28.8,37 27.5,38.3 23.6,38.3 23.27,38.62 R35.1 21.73,39.52 21.48,39.27 Q4.C
IN_R  (via drill 0.35)
  Top 0.254: R28.1 v49.4,37.5 Q1.C | IC1.26 33.6,36.2 v34.35,36.95
  Bottom 0.254: v49.4,37.5 48.54,37.5 47.99,36.95 v34.35,36.95
KEEP_SYS_EN  (via drill 0.35)
  Top 0.254: IC13.2 39.6,13.9 39.8,13.7 v41.5,13.7 42,13.2 44.7,13.2 45.2,13.7 TP20.TP | v32.6,23.7 32.6,31.8 32.2,32.2 29.9,32.2 29.5,31.8 29.5,29 28.9,28.4 IC1.38
  Bottom 0.254: v41.5,13.7 36.2,13.7 34.7,15.2 33,15.2 32.6,15.6 v32.6,23.7
LASER_MOD  (via drill 0.35)
  Top 0.254: IC1.3 v29.6,25.9 30.65,25.9 31.15,26.4 v31.15,31.41 | U2.1 14.25,39.55 13.65,38.95 v13.65,26.55 | U1.1 52.3,39.7 v52.3,39.66
  Bottom 0.254: v29.6,25.9 29.32,25.62 14.58,25.62 v13.65,26.55 | v31.15,31.41 31.15,35.88 33.98,38.71 51.35,38.71 v52.3,39.66
LED_HB
  Top 0.254: IC1.11 36,20.4 36.75,19.65 LED2.A
LED_STS  (via drill 0.35)
  Top 0.254: IC1.1 v28,20.45
  Bottom 0.254: v28,20.45 17.5,20.45 16.7,19.65 16.7,4.03 LED1.A
MAX_SYS_ON
  Top 0.254: IC13.1 IC10.5 38.95,11.95 39.3,11.6 TP21.TP
N$1
  Top 0.254: IC4.RESETB R9.2 12.55,25.4 11.25,26.7 TP11.TP
N$2
  Top 0.254: TP12.TP IC4.PIO0
N$3
  Top 0.61: Q3.C 8.4,44.8 8.65,44.55 R36.1
  Top 1.27: J7.1 5.1,45 6.17,46.08 Q3.C
N$4  (via drill 0.35)
  Top 0.254: IC4.PIO1 v9,21 | v9,6.75 6.85,6.75 R10.1
  Bottom 0.254: v9,21 v9,6.75
N$5
  Top 0.2: IC11.4 52.5,17.5
  Top 0.203: L4.1 53.08,16.92 52.5,17.5
N$6
  Top 0.254: R10.2 7.9,4 LED3.A
N$7
  Top 0.203: IC6.1 62,24.5 63.35,25.85 R14.2
N$8
  Top 0.2: IC6.12 60.75,20.8 61.65,19.9 63.6,19.9 64.15,19.35 R17.2
N$9
  Top 0.203: IC6.16 R18.2
N$10
  Top 0.254: LED1.K R1.1
N$11
  Top 0.203: IC3.1 28.8,37.8 29.6,37 IC1.31
N$12
  Top 0.254: R16.2 LED4.A
N$13
  Top 0.254: R32.2 R34.1 20.8,41.58 Q4.B
N$14
  Top 0.254: Q3.B 10.7,45.23 R33.1 | R33.1 14.35,45.23 14.72,45.6 R31.2 | TP26.TP 12.75,43.4 13.3,43.95 R33.1
N$15
  Top 0.61: R36.2 11.25,42.33 LED6.C
N$16
  Top 0.254: U2.4 16.15,44.17 17,45.02 R31.1
N$17
  Top 0.203: L3.1 C20.1 C18.2
N$19
  Top 0.203: IC3.3 31.2,37.8 30.4,37 IC1.30
N$20
  Top 0.169: 30.1,48.2 R22.1
  Top 0.203: L3.2 C21.1 30.1,48.2
  Top 0.254: R22.1 R21.1
N$21
  Top 0.254: IC1.7 32.8,20.8 32,20 C3.1
N$22
  Top 0.254: IC7.9 43,41.1 43.95,40.15 IC8.1
N$23
  Top 0.203: R22.2 25.55,47.15 arc-90 24.9,47.8 24.9,48.83 arc90 J3.1
N$24
  Top 0.254: R19.1 36,42.6 37,41.6 IC7.16
N$25
  Top 0.254: C16.1 37.25,39.85 37.5,40.1 IC7.19
N$26
  Top 0.254: R25.2 50.25,45.12 R27.1 50.25,41.1 Q1.B
N$27
  Top 0.254: J4.2 50.35,47.85 R25.1
N$28
  Top 0.254: J6.2 12.5,49.25 15.2,46.55 R32.1
N$29
  Top 0.254: LED2.C 37.6,17.35 37.6,16.8 37.25,16.45 R2.1
N$30
  Top 0.203: IC5.10 56,32.4 57.1,33.5 R12.2
N$31
  Top 0.254: IC7.10 43,41.6 43.95,42.55 IC8.3
N$32
  Top 0.203: IC7.13 40.5,43.7 40.2,44 L1.1 C18.1
N$33
  Top 0.203: IC7.12 41,43.6 41.4,44 L1.2 41.45,46.05 L2.1
N$34
  Top 0.2: IC11.2 51.5,17.5
  Top 0.203: L4.2 50.92,16.92 51.5,17.5
N$35
  Top 0.203: 43.85,44.85 L2.2 42.8,42.9 42.45,42.55 IC7.11 | C19.1 44.15,45.15 43.85,44.85 | C17.1 44.15,44.55 43.85,44.85
N$36
  Top 0.508: ANT1.P$2 C23.1
N$37
  Top 0.203: ANT1.P$1 R21.2
  Top 0.508: C22.1 ANT1.P$1
N$38
  Top 0.61: Q2.C 59.27,45.83 R30.1
  Top 1.27: J5.1 63.3,45 62.23,46.08 Q2.C
N$39
  Top 0.254: Q2.B 57.23,46.92 R29.1 R26.2 52.17,46.92 51.25,46 51.02,46 49.68,46 TP25.TP
N$40
  Top 0.61: R30.2 56.67,42.33 LED5.C
N$41
  Top 0.203: R4.1 R3.2 9.77,34.9 C6.1
  Top 0.254: X1.1 11.13,37.27 10.94,37.47 R4.1
N$42
  Top 0.2: R26.1 53.05,43.8 53.53,43.31 U1.4
N$43  (via drill 1)
  other vias: 58.5,10.7
N$58
  Top 0.203: S1.2 38,5.3 IC10.1
N$59
  Top 0.2: IC12.4 59,8
  Top 0.203: L5.1 59.58,7.42 59,8
N$60
  Top 0.2: IC11.8 IC11.7
  Top 0.203: IC11.7 52.5,23.5 | 52.5,23.5 52.25,23.75 C27.1 | 52.5,23.5 52.75,23.75 R23.1
N$61
  Top 0.2: IC12.2 58,8
  Top 0.203: L5.2 57.42,7.42 58,8
N$62
  Top 0.203: IC12.7 59,14 | 59,14 59.25,14.25 R24.1 | 59,14 58.75,14.25 C28.1
  Top 0.254: IC12.8 IC12.7
NRF_!CS
  Top 0.254: IC7.2 40,37.6 39.55,37.15 TP6.TP 39.55,32.43 39.96,32.02 39.96,31.28 39.48,30.8 IC1.21
NRF_CE  (via drill 0.35)
  Top 0.254: IC7.1 39.5,37.85 38.5,36.85 TP8.TP v38.5,32.8 | IC1.15 v39.55,26
  Bottom 0.254: v39.55,26 38.5,27.05 v38.5,32.8
NRF_IRQ
  Top 0.254: IC7.6 42.92,39.6 43.51,39.01 43.51,35.41 TP5.TP R20.1 IC1.19
PGEC  (via drill 0.35)
  Top 0.254: v35.4,24.4 IC1.13
  Bottom 0.254: SV1.5 7.89,27.3 10.8,24.4 v35.4,24.4
PGED  (via drill 0.35)
  Top 0.254: v36.2,23.6 IC1.12
  Bottom 0.254: SV1.4 5.96,29.84 10.99,24.81 34.88,24.81 35.13,25.06 35.67,25.06 36.06,24.67 36.06,23.74 v36.2,23.6
SPI1_SCK  (via drill 0.35)
  Top 0.254: IC1.14 v40.5,25.2 | v40.5,30.86 TP7.TP IC7.3
  Bottom 0.254: v40.5,25.2 v40.5,30.86
SPI1_SDI  (via drill 0.35)
  Top 0.254: IC7.5 41.5,37.85 42.5,36.85 TP4.TP v42.5,31.6 | IC1.22 v39.3,31.6
  Bottom 0.254: v39.3,31.6 v42.5,31.6
SPI1_SDO
  Top 0.254: IC7.4 41,37.6 41.5,37.1 TP3.TP 41.5,30.4 41.1,30 IC1.20
STS_L  (via drill 0.35)
  Top 0.254: IC1.44 27.55,23.6 27.65,23.7 v27.65,26.5
  Bottom 0.254: v27.65,26.5 27.65,29.3 26.3,30.65 14.6,30.65 14,31.25 14,50 J6.3
STS_R  (via drill 0.35)
  Top 0.254: IC1.25 v34.4,34.8
  Bottom 0.254: v34.4,34.8 v34.39,34.81 34.39,35.57 34.97,36.15 55.1,36.15 56,37.05 J4.3
SYS_EN  (via drill 0.35)
  Top 0.2: IC12.6 v60.8,12.35
  Top 0.254: v53.75,22.4 53.2,22.4 53,22.2 IC11.6 | IC13.4 40.25,17.95 39.65,18.55 | 39.65,18.55 v38.95,18.55 | TP24.TP 39.65,19.35 39.65,18.55
  Bottom 0.254: v38.95,18.55 38.95,21.9 39.45,22.4 v53.75,22.4 53.85,22.4 54.65,23.2 56.8,23.2 60.8,19.2 v60.8,12.35
U1_RX
  Top 0.254: IC1.36 21.15,30 20.45,29.3 TP9.TP 20.45,12.95 19.85,12.35 9.75,12.35 9,11.6 IC4.UART_TX
U1_TX
  Top 0.254: IC4.UART_RX 12,11.1 12.4,11.5 TP10.TP 23,11.5 24.2,12.7 24.2,23.65 24.95,24.4 IC1.43
U2_RX
  Top 0.254: IC1.4 30.4,20.48 29.99,20.07 29.99,16.44 JP1.2
U2_TX
  Top 0.254: IC1.5 31.2,20.7 30.4,19.9 JP1.1
USB_D+  (via drill 0.35)
  Top 0.203: J1.3 27.99,6.54 28.6,7.15 28.6,8.47 IC2.6 IC2.1
  Top 0.254: IC2.1 v33.6,11 | v33.6,13.4 IC1.8
  Bottom 0.254: v33.6,11 v33.6,13.4
USB_D-
  Top 0.203: J1.2 27.34,6.46 26.65,7.15 26.65,8.47 IC2.4 IC2.3
  Top 0.254: IC2.3 26.68,11.82 27.15,12.3 34.05,12.3 34.4,12.65 IC1.9
USB_ID  (via drill 0.35)
  Top 0.254: J1.4 28.64,5.99 v28.95,6.3 | v22.35,17.9 22.35,24.15 24.2,26 IC1.41
  Bottom 0.254: v22.35,17.9 22.35,8.5 23,7.85 28.65,7.85 28.95,7.55 v28.95,6.3
VBAT
  Top 0.2: TP14.TP 57.35,31.2
  Top 0.203: IC5.7 57.35,31.2 60.6,31.2 61.2,30.6 R11.2
  pour Top (no thermals): 59.25,29.75 59.25,25.5 59.5,25.5 59.5,24.25 60.5,24.25 60.5,25.5 63,25.5 63,29.75
VCCINT  (via drill 0.35)
  Top 0.254: R24.2 v63.95,14.25 | TP19.TP v64.3,11.25 | R16.1 v47.15,5.1 | v38,11.4 IC10.6 38,14.9 38.95,15.85 IC13.5 | R23.2 v55.35,22.5
  Route15 0.254: v63.9,8.65 63.9,7.35 61.65,5.1 v47.15,5.1 46.35,5.1 45.65,5.8 45.65,10.85 45.1,11.4 v38,11.4
  Bottom 0.254: v55.35,22.5 55.35,19.85 55.15,19.65 v55.15,16.7
  other vias: 59.05,17.4 60,17.4 60,16.45 59.05,16.45 54.2,17.85 54.2,16.7 56.1,16.7 65.15,8.65
  pour Route15: 52.75,19.05 65.85,19.05 65.85,7.55 52.75,7.55
  pour Top (no thermals): 59.65,21.7 59.65,19.9 58.5,18.75 58.5,15.95 60.6,15.95 60.6,19.55 60.35,19.8 60.35,21.7
  pour Top (no thermals): 52.85,18.6 52.85,16.15 56.65,16.15 56.65,18.6
  pour Top (no thermals): 59.4,9.6 59.4,7.5 65.9,7.5 65.9,9.6
VDD  (via drill 0.35)
  Top 0.254: v24.3,6.3 22.95,6.3 TP15.TP | IC1.42 24.85,25.2 23.6,23.95 23.6,17.95 v21.55,15.9
  Bottom 0.254: v21.55,15.9 21.55,7.05 22.3,6.3 v24.3,6.3 | 25.4,6.25 v25.45,6.3
  Bottom 1.27: 64,20.75 v64,20.65 64,18.35 61.97,16.32 61.97,6.37 57.24,1.65 25.9,1.65 25.45,2.1 v25.45,4.9 v25.45,6.3
  other vias: 63,21.85 64,21.85 63,20.65 24.3,4.9
  pour Top (no thermals): 23.7,6.95 26.85,6.95 26.85,4.25 23.7,4.25
  pour Top (rank 2, no thermals): 61.15,22.35 64.55,22.35 64.55,20.25 64.6,20.2 62.6,20.2 61.15,21.65
  pour Bottom (no thermals): 62.55,20.2 62.55,22.35 64.55,22.35 64.55,20.2
  pour Bottom (no thermals): 23.65,7 26,7 26,4.2 23.65,4.2

### Text on the board
Top: 1
Route2: 2
Route15: 3
Bottom: 4
Measures: GF: / - Induttori TPS / - Shunt batteria / - Power distribution